# Altium project Temp.PrjPcb (part 1 of 2)
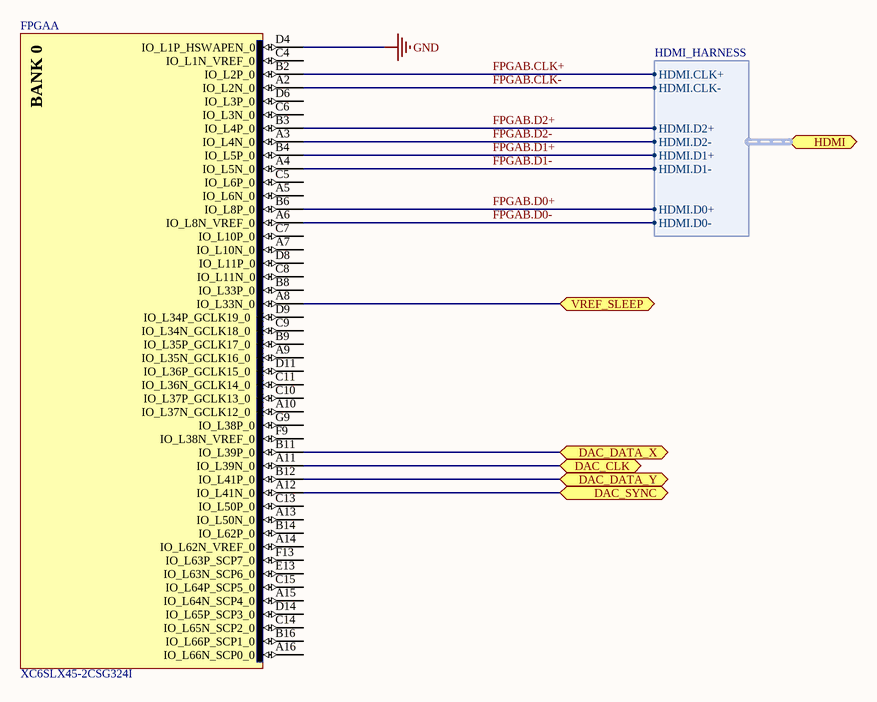
[diagram p0: FPGA Bank 0.SchDoc]
18 sheets, 125 parts. Net scope: flat (ports and power ports of the same name join across sheets).
Board files: PCB1.PcbDoc, VECTOR.PcbDoc, VECTOR_routed.PcbDoc
Sheets:
  Temp.SchDoc
  FPGA Bank 0.SchDoc
  FPGA Bank 1.SchDoc
  FPGA Bank 2.SchDoc
  Clocks.SchDoc
  EFM Power.SchDoc
  FPGA Config.SchDoc
  FPGA Bank 3.SchDoc
  FPGA_VCC.SchDoc
  FPGA Ground.SchDoc
  EFM.SchDoc
  DAC.SchDoc
  SRAM.SchDoc
  Power Supply.SchDoc
  Flash.SchDoc
  HDMI.SchDoc
  JoystickButtons.SchDoc
  Frame Buffer.SchDoc

## Sheet Temp.SchDoc
size A4

## Sheet FPGA Bank 0.SchDoc
size A4

### Parts
FPGA  XC6SLX45-2CSG324I  [CSG324]  (part A of 8)

### Ports
DAC_CLK, DAC_DATA_X, DAC_DATA_Y, DAC_SYNC, HDMI (harness HDMI_HARNESS), VREF_SLEEP

### Harnesses
HDMI_HARNESS: HDMI.D2+, HDMI.D2-, HDMI.D1+, HDMI.D1-, HDMI.D0+, HDMI.D0-, HDMI.CLK+, HDMI.CLK-

### Nets
GND: FPGA.D4(IO_L1P_HSWAPEN_0)
FPGAB.CLK+: FPGA.B2(IO_L2P_0) ; port HDMI.HDMI.CLK+
FPGAB.CLK-: FPGA.A2(IO_L2N_0) ; port HDMI.HDMI.CLK-
FPGAB.D0+: FPGA.B6(IO_L8P_0) ; port HDMI.HDMI.D0+
FPGAB.D0-: FPGA.A6(IO_L8N_VREF_0) ; port HDMI.HDMI.D0-
FPGAB.D1+: FPGA.B4(IO_L5P_0) ; port HDMI.HDMI.D1+
FPGAB.D1-: FPGA.A4(IO_L5N_0) ; port HDMI.HDMI.D1-
FPGAB.D2+: FPGA.B3(IO_L4P_0) ; port HDMI.HDMI.D2+
FPGAB.D2-: FPGA.A3(IO_L4N_0) ; port HDMI.HDMI.D2-
NetFPGA_A8: FPGA.A8(IO_L33N_0) ; port VREF_SLEEP
NetFPGA_A11: FPGA.A11(IO_L39N_0) ; port DAC_CLK
NetFPGA_A12: FPGA.A12(IO_L41N_0) ; port DAC_SYNC
NetFPGA_B11: FPGA.B11(IO_L39P_0) ; port DAC_DATA_X
NetFPGA_B12: FPGA.B12(IO_L41P_0) ; port DAC_DATA_Y

Not connected (* = marked no-connect by the designer): FPGA A5(IO_L6N_0) A7(IO_L10N_0) A9(IO_L35N_GCLK16_0) A10(IO_L37N_GCLK12_0) A13(IO_L50N_0) A14(IO_L62N_VREF_0) A15(IO_L64N_SCP4_0) A16(IO_L66N_SCP0_0) B8(IO_L33P_0) B9(IO_L35P_GCLK17_0) B14(IO_L62P_0) B16(IO_L66P_SCP1_0) C4(IO_L1N_VREF_0) C5(IO_L6P_0) C6(IO_L3N_0) C7(IO_L10P_0) C8(IO_L11N_0) C9(IO_L34N_GCLK18_0) C10(IO_L37P_GCLK13_0) C11(IO_L36N_GCLK14_0) C13(IO_L50P_0) C14(IO_L65N_SCP2_0) C15(IO_L64P_SCP5_0) D6(IO_L3P_0) D8(IO_L11P_0) D9(IO_L34P_GCLK19_0) D11(IO_L36P_GCLK15_0) D14(IO_L65P_SCP3_0) E13(IO_L63N_SCP6_0) F9(IO_L38N_VREF_0) F13(IO_L63P_SCP7_0) G9(IO_L38P_0)

### Notes on the sheet
- (in symbol XC6SLX45-2CSG324I, part A) BANK 0

### Library data of the parts
FPGA = XC6SLX45-2CSG324I: Spartan-6 LX 1.2V FPGA, 218 User I/Os, 324-Ball Chip-Scale BGA (0.8mm Pitch), Speed Grade 2, Industrial Grade, Pb-Free; Published: 17-Nov-2009; DatasheetVersion: ver1.6, Nov-2010; PackageVersion: ver1.1, Nov-2009; PackageReference: CSG324; Publisher: Altium Limited; PackageDescription: 324-Ball Chip-Scale BGA (CSG324) Package, 0.8 mm Pitch; Supplier 1: Digi-Key; Supplier Part Number 1: XC6SLX45-2CSG324I-ND; Code_JEDEC: MO-275-KKAC-1; ComponentLink1Description: Manufacturer Link; ComponentLink1URL: http://www.xilinx.com; ComponentLink2Description: Spartan-6 Datasheet; ComponentLink2URL: http://www.xilinx.com/support/documentation/data_sheets/ds160.pdf; ComponentLink3Description: Spartan-6 Documents; ComponentLink3URL: http://www.xilinx.com/support/documentation/spartan-6.htm; ComponentLink4Description: Xilinx.com Home; ComponentLink4URL: http://www.xilinx.com

## Sheet FPGA Bank 1.SchDoc
size A4
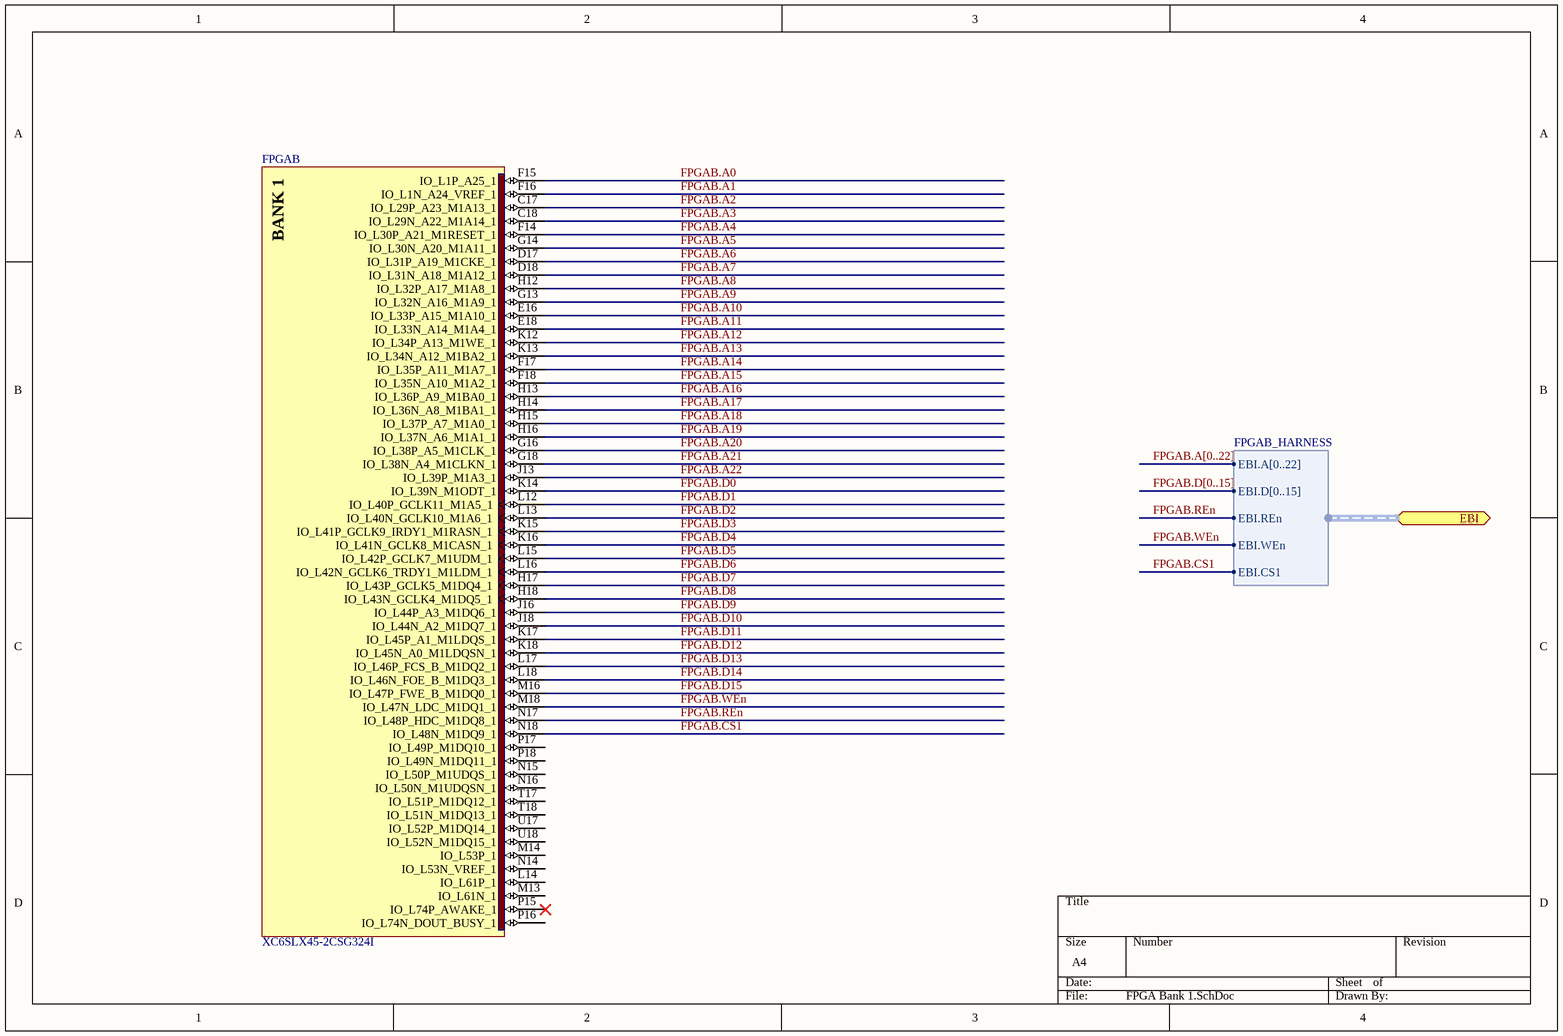
[diagram p1: FPGA Bank 1.SchDoc]

### Parts
FPGA  XC6SLX45-2CSG324I  [CSG324]  (part B of 8)

### Ports
EBI (harness FPGAB_HARNESS)

### Harnesses
FPGAB_HARNESS: EBI.A[0..22], EBI.D[0..15], EBI.REn, EBI.WEn, EBI.CS1

### Nets
FPGAB.A0: FPGA.F15(IO_L1P_A25_1)  [project net EBI.A0]
FPGAB.A1: FPGA.F16(IO_L1N_A24_VREF_1)  [project net EBI.A1]
FPGAB.A2: FPGA.C17(IO_L29P_A23_M1A13_1)  [project net EBI.A2]
FPGAB.A3: FPGA.C18(IO_L29N_A22_M1A14_1)  [project net EBI.A3]
FPGAB.A4: FPGA.F14(IO_L30P_A21_M1RESET_1)  [project net EBI.A4]
FPGAB.A5: FPGA.G14(IO_L30N_A20_M1A11_1)  [project net EBI.A5]
FPGAB.A6: FPGA.D17(IO_L31P_A19_M1CKE_1)  [project net EBI.A6]
FPGAB.A7: FPGA.D18(IO_L31N_A18_M1A12_1)  [project net EBI.A7]
FPGAB.A8: FPGA.H12(IO_L32P_A17_M1A8_1)  [project net EBI.A8]
FPGAB.A9: FPGA.G13(IO_L32N_A16_M1A9_1)  [project net EBI.A9]
FPGAB.A10: FPGA.E16(IO_L33P_A15_M1A10_1)  [project net EBI.A10]
FPGAB.A11: FPGA.E18(IO_L33N_A14_M1A4_1)  [project net EBI.A11]
FPGAB.A12: FPGA.K12(IO_L34P_A13_M1WE_1)  [project net EBI.A12]
FPGAB.A13: FPGA.K13(IO_L34N_A12_M1BA2_1)  [project net EBI.A13]
FPGAB.A14: FPGA.F17(IO_L35P_A11_M1A7_1)  [project net EBI.A14]
FPGAB.A15: FPGA.F18(IO_L35N_A10_M1A2_1)  [project net EBI.A15]
FPGAB.A16: FPGA.H13(IO_L36P_A9_M1BA0_1)  [project net EBI.A16]
FPGAB.A17: FPGA.H14(IO_L36N_A8_M1BA1_1)  [project net EBI.A17]
FPGAB.A18: FPGA.H15(IO_L37P_A7_M1A0_1)  [project net EBI.A18]
FPGAB.A19: FPGA.H16(IO_L37N_A6_M1A1_1)  [project net EBI.A19]
FPGAB.A20: FPGA.G16(IO_L38P_A5_M1CLK_1)  [project net EBI.A20]
FPGAB.A21: FPGA.G18(IO_L38N_A4_M1CLKN_1)  [project net EBI.A21]
FPGAB.A22: FPGA.J13(IO_L39P_M1A3_1)  [project net EBI.A22]
FPGAB.CS1: FPGA.N18(IO_L48N_M1DQ9_1) ; port EBI.EBI.CS1  [project net EBI.CS1]
FPGAB.D0: FPGA.K14(IO_L39N_M1ODT_1)  [project net EBI.D0]
FPGAB.D1: FPGA.L12(IO_L40P_GCLK11_M1A5_1)  [project net EBI.D1]
FPGAB.D2: FPGA.L13(IO_L40N_GCLK10_M1A6_1)  [project net EBI.D2]
FPGAB.D3: FPGA.K15(IO_L41P_GCLK9_IRDY1_M1RASN_1)  [project net EBI.D3]
FPGAB.D4: FPGA.K16(IO_L41N_GCLK8_M1CASN_1)  [project net EBI.D4]
FPGAB.D5: FPGA.L15(IO_L42P_GCLK7_M1UDM_1)  [project net EBI.D5]
FPGAB.D6: FPGA.L16(IO_L42N_GCLK6_TRDY1_M1LDM_1)  [project net EBI.D6]
FPGAB.D7: FPGA.H17(IO_L43P_GCLK5_M1DQ4_1)  [project net EBI.D7]
FPGAB.D8: FPGA.H18(IO_L43N_GCLK4_M1DQ5_1)  [project net EBI.D8]
FPGAB.D9: FPGA.J16(IO_L44P_A3_M1DQ6_1)  [project net EBI.D9]
FPGAB.D10: FPGA.J18(IO_L44N_A2_M1DQ7_1)  [project net EBI.D10]
FPGAB.D11: FPGA.K17(IO_L45P_A1_M1LDQS_1)  [project net EBI.D11]
FPGAB.D12: FPGA.K18(IO_L45N_A0_M1LDQSN_1)  [project net EBI.D12]
FPGAB.D13: FPGA.L17(IO_L46P_FCS_B_M1DQ2_1)  [project net EBI.D13]
FPGAB.D14: FPGA.L18(IO_L46N_FOE_B_M1DQ3_1)  [project net EBI.D14]
FPGAB.D15: FPGA.M16(IO_L47P_FWE_B_M1DQ0_1)  [project net EBI.D15]
FPGAB.REn: FPGA.N17(IO_L48P_HDC_M1DQ8_1) ; port EBI.EBI.REn  [project net EBI.REn]
FPGAB.WEn: FPGA.M18(IO_L47N_LDC_M1DQ1_1) ; port EBI.EBI.WEn  [project net EBI.WEn]

Not connected (* = marked no-connect by the designer): FPGA L14(IO_L61P_1) M13(IO_L61N_1) M14(IO_L53P_1) N14(IO_L53N_VREF_1) N15(IO_L50P_M1UDQS_1) N16(IO_L50N_M1UDQSN_1) P15(IO_L74P_AWAKE_1)* P16(IO_L74N_DOUT_BUSY_1) P17(IO_L49P_M1DQ10_1) P18(IO_L49N_M1DQ11_1) T17(IO_L51P_M1DQ12_1) T18(IO_L51N_M1DQ13_1) U17(IO_L52P_M1DQ14_1) U18(IO_L52N_M1DQ15_1)

### Buses and harness runs
bus FPGAB.A[0..22]
bus FPGAB.D[0..15]

### Notes on the sheet
- (in symbol XC6SLX45-2CSG324I, part B) BANK 1

### Library data of the parts
FPGA = XC6SLX45-2CSG324I: as FPGA on sheet FPGA Bank 0; Published: 17-Nov-2009; DatasheetVersion: ver1.6, Nov-2010; PackageVersion: ver1.1, Nov-2009; PackageReference: CSG324; Publisher: Altium Limited; PackageDescription: 324-Ball Chip-Scale BGA (CSG324) Package, 0.8 mm Pitch; Supplier 1: Digi-Key; Supplier Part Number 1: XC6SLX45-2CSG324I-ND; Code_JEDEC: MO-275-KKAC-1; ComponentLink1Description: Manufacturer Link; ComponentLink1URL: http://www.xilinx.com; ComponentLink2Description: Spartan-6 Datasheet; ComponentLink2URL: http://www.xilinx.com/support/documentation/data_sheets/ds160.pdf; ComponentLink3Description: Spartan-6 Documents; ComponentLink3URL: http://www.xilinx.com/support/documentation/spartan-6.htm; ComponentLink4Description: Xilinx.com Home; ComponentLink4URL: http://www.xilinx.com

## Sheet FPGA Bank 2.SchDoc
size A4
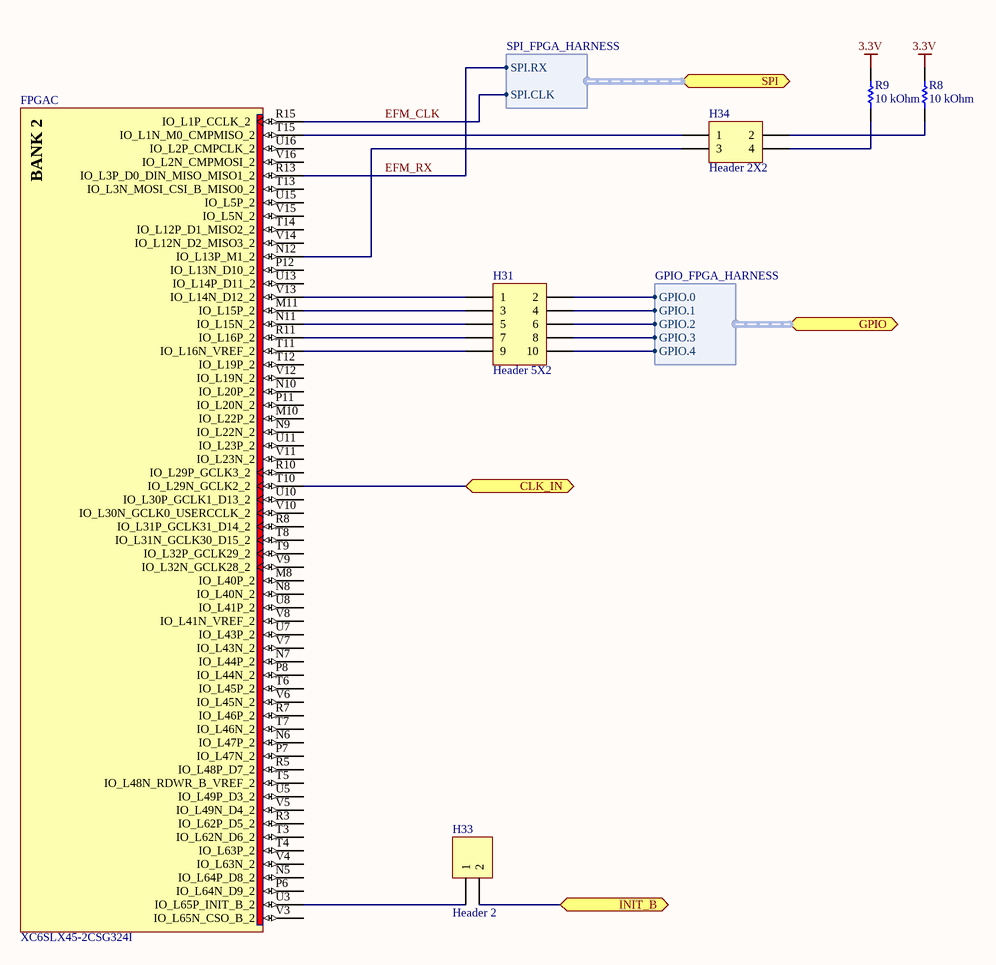
[diagram p2: FPGA Bank 2.SchDoc]

### Parts
FPGA  XC6SLX45-2CSG324I  [CSG324]  (part C of 8)
H31  Header 5X2  [HDR2X5]
H33  Header 2  [HDR1X2]
H34  Header 2X2  [HDR2X2]
R8  10 kOhm  [RESC0603(1608)_M]
R9  10 kOhm  [RESC0603(1608)_M]

### Ports
CLK_IN, GPIO (harness GPIO_FPGA_HARNESS), INIT_B, SPI (harness SPI_FPGA_HARNESS)

### Harnesses
GPIO_FPGA_HARNESS: GPIO.0, GPIO.1, GPIO.2, GPIO.3, GPIO.4
SPI_FPGA_HARNESS: SPI.RX, SPI.CLK

### Nets
3.3V: R8.2 R9.2
EFM_CLK: FPGA.R15(IO_L1P_CCLK_2) ; port SPI.SPI.CLK
EFM_RX: FPGA.R13(IO_L3P_D0_DIN_MISO_MISO1_2) ; port SPI.SPI.RX
GPIO.0: H31.2 ; port GPIO.GPIO.0
GPIO.1: H31.4 ; port GPIO.GPIO.1
GPIO.2: H31.6 ; port GPIO.GPIO.2
GPIO.3: H31.8 ; port GPIO.GPIO.3
GPIO.4: H31.10 ; port GPIO.GPIO.4
NetEFM32_H8: H33.2 ; port INIT_B
NetFPGA_M11: FPGA.M11(IO_L15P_2) H31.3
NetFPGA_N11: FPGA.N11(IO_L15N_2) H31.5
NetFPGA_N12: FPGA.N12(IO_L13P_M1_2) H34.3
NetFPGA_R11: FPGA.R11(IO_L16P_2) H31.7
NetFPGA_T10: FPGA.T10(IO_L29N_GCLK2_2) ; port CLK_IN
NetFPGA_T11: FPGA.T11(IO_L16N_VREF_2) H31.9
NetFPGA_T15: FPGA.T15(IO_L1N_M0_CMPMISO_2) H34.1
NetFPGA_U3: FPGA.U3(IO_L65P_INIT_B_2) H33.1
NetFPGA_V13: FPGA.V13(IO_L14N_D12_2) H31.1
NetH34_2: H34.2 R8.1
NetH34_4: H34.4 R9.1

Not connected (* = marked no-connect by the designer): FPGA M8(IO_L40P_2) M10(IO_L22P_2) N5(IO_L64P_D8_2) N6(IO_L47P_2) N7(IO_L44P_2) N8(IO_L40N_2) N9(IO_L22N_2) N10(IO_L20P_2) P6(IO_L64N_D9_2) P7(IO_L47N_2) P8(IO_L44N_2) P11(IO_L20N_2) P12(IO_L13N_D10_2) R3(IO_L62P_D5_2) R5(IO_L48P_D7_2) R7(IO_L46P_2) R8(IO_L31P_GCLK31_D14_2) R10(IO_L29P_GCLK3_2) T3(IO_L62N_D6_2) T4(IO_L63P_2) T5(IO_L48N_RDWR_B_VREF_2) T6(IO_L45P_2) T7(IO_L46N_2) T8(IO_L31N_GCLK30_D15_2) T9(IO_L32P_GCLK29_2) T12(IO_L19P_2) T13(IO_L3N_MOSI_CSI_B_MISO0_2) T14(IO_L12P_D1_MISO2_2) U5(IO_L49P_D3_2) U7(IO_L43P_2) U8(IO_L41P_2) U10(IO_L30P_GCLK1_D13_2) U11(IO_L23P_2) U13(IO_L14P_D11_2) U15(IO_L5P_2) U16(IO_L2P_CMPCLK_2) V3(IO_L65N_CSO_B_2) V4(IO_L63N_2) V5(IO_L49N_D4_2) V6(IO_L45N_2) V7(IO_L43N_2) V8(IO_L41N_VREF_2) V9(IO_L32N_GCLK28_2) V10(IO_L30N_GCLK0_USERCCLK_2) V11(IO_L23N_2) V12(IO_L19N_2) V14(IO_L12N_D2_MISO3_2) V15(IO_L5N_2) V16(IO_L2N_CMPMOSI_2)

### Notes on the sheet
- (in symbol XC6SLX45-2CSG324I, part C) BANK 2

### Library data of the parts
FPGA = XC6SLX45-2CSG324I: as FPGA on sheet FPGA Bank 0; Published: 17-Nov-2009; DatasheetVersion: ver1.6, Nov-2010; PackageVersion: ver1.1, Nov-2009; PackageReference: CSG324; Publisher: Altium Limited; PackageDescription: 324-Ball Chip-Scale BGA (CSG324) Package, 0.8 mm Pitch; Supplier 1: Digi-Key; Supplier Part Number 1: XC6SLX45-2CSG324I-ND; Code_JEDEC: MO-275-KKAC-1; ComponentLink1Description: Manufacturer Link; ComponentLink1URL: http://www.xilinx.com; ComponentLink2Description: Spartan-6 Datasheet; ComponentLink2URL: http://www.xilinx.com/support/documentation/data_sheets/ds160.pdf; ComponentLink3Description: Spartan-6 Documents; ComponentLink3URL: http://www.xilinx.com/support/documentation/spartan-6.htm; ComponentLink4Description: Xilinx.com Home; ComponentLink4URL: http://www.xilinx.com
H31 = Header 5X2: Header, 5-Pin, Dual row; LatestRevisionDate: 17-Jul-2002; LatestRevisionNote: Re-released for DXP Platform.; Publisher: Altium Limited
H33 = Header 2: Header, 2-Pin; LatestRevisionDate: 17-Jul-2002; LatestRevisionNote: Re-released for DXP Platform.; Publisher: Altium Limited
H34 = Header 2X2: Header, 2-Pin, Dual row; LatestRevisionDate: 17-Jul-2002; LatestRevisionNote: Re-released for DXP Platform.; Publisher: Altium Limited
R8 R9 = CMP-1012-00002-1: 1R 0.1W 5% 0603 (1608 Metric)  SMD; Case-Metric: 1608; Case-EIA: 0603; Power: 0.1 W; Technology: SMT; Value: 10 kOhm; Tolerance: 5 %

## Sheet Clocks.SchDoc
size A4
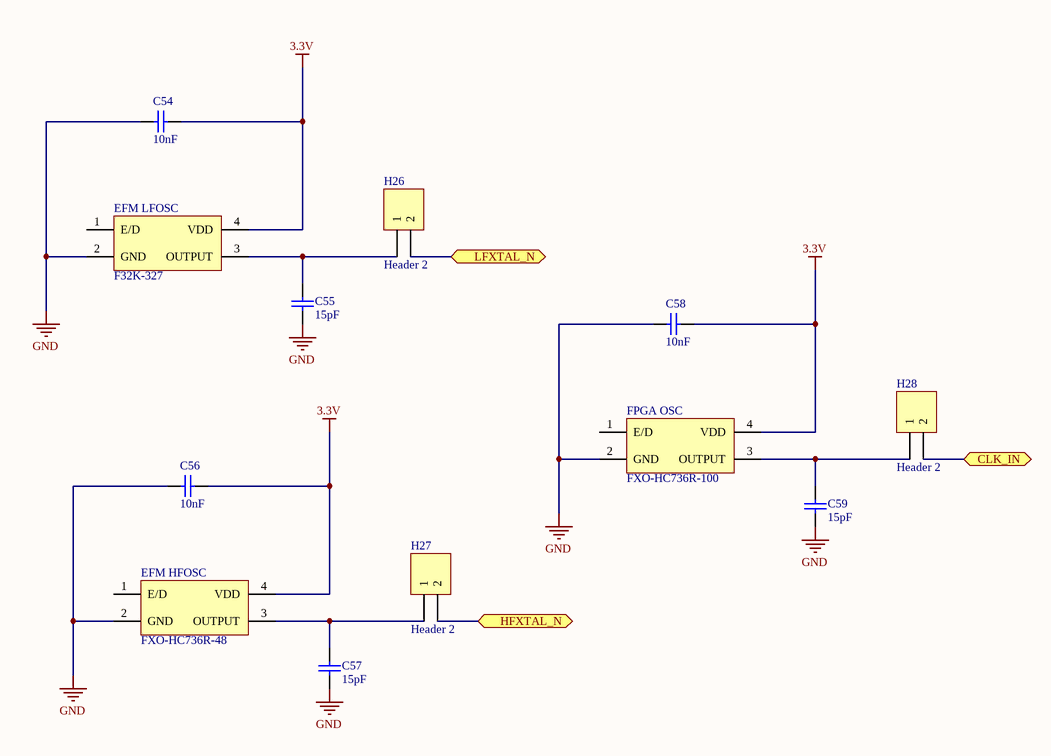
[diagram p3: Clocks.SchDoc]

### Parts
C54  10nF  [CAPC0603(1608)100_M]
C55  15pF  [CAPC0603(1608)100_M]
C56  10nF  [CAPC0603(1608)100_M]
C57  15pF  [CAPC0603(1608)100_M]
C58  10nF  [CAPC0603(1608)100_M]
C59  15pF  [CAPC0603(1608)100_M]
EFM_HFOSC  FXO-HC736R-48  [FPGA-OSC]
EFM_LFOSC  F32K-327  [LFOSC-32]
FPGA_OSC  FXO-HC736R-100  [FPGA-OSC]
H26  Header 2  [HDR1X2]
H27  Header 2  [HDR1X2]
H28  Header 2  [HDR1X2]

### Ports
CLK_IN, HFXTAL_N, LFXTAL_N

### Nets
3.3V: C54.2 C56.2 C58.2 EFM_HFOSC.4(VDD) EFM_LFOSC.4(VDD) FPGA_OSC.4(VDD)
GND: C54.1 C55.1 C56.1 C57.1 C58.1 C59.1 EFM_HFOSC.2(GND) EFM_LFOSC.2(GND) FPGA_OSC.2(GND)
NetC55_2: C55.2 EFM_LFOSC.3(OUTPUT) H26.1
NetC57_2: C57.2 EFM_HFOSC.3(OUTPUT) H27.1
NetC59_2: C59.2 FPGA_OSC.3(OUTPUT) H28.1
NetEFM32_L1: H26.2 ; port LFXTAL_N
NetEFM32_L9: H27.2 ; port HFXTAL_N
NetFPGA_T10: H28.2 ; port CLK_IN

Not connected (* = marked no-connect by the designer): EFM_HFOSC 1(E/D); EFM_LFOSC 1(E/D); FPGA_OSC 1(E/D)

### Library data of the parts
C54-C59 = CMP-1035-00001-1: CAP 0.5pF 10V Â±0.1pF 0603 (1608 Metric) Thickness 1mm SMD; Case-EIA: 0603; Case-Metric: 1608; Max Thickness: 1 mm; Tolerance: Â±0.1pF; Technology: SMT; Rated Voltage: 10 V
  C54 C56 C58: Value: 10nF
  C55 C57 C59: Value: 15pF
H26-H28 = Header 2: Header, 2-Pin; LatestRevisionDate: 17-Jul-2002; LatestRevisionNote: Re-released for DXP Platform.; Publisher: Altium Limited

## Sheet EFM Power.SchDoc
size A4
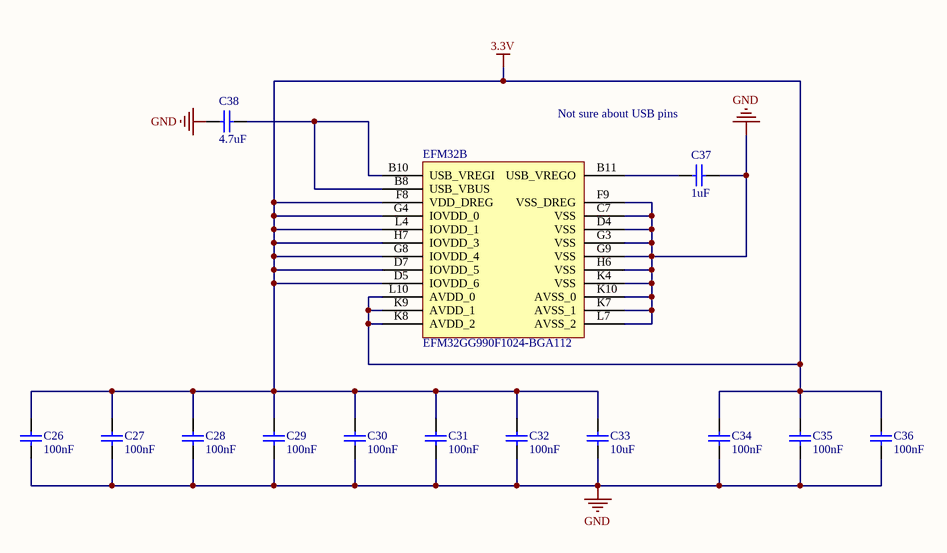
[diagram p4: EFM Power.SchDoc]

### Parts
C26  100nF  [CAPC0603(1608)100_M]
C27  100nF  [CAPC0603(1608)100_M]
C28  100nF  [CAPC0603(1608)100_M]
C29  100nF  [CAPC0603(1608)100_M]
C30  100nF  [CAPC0603(1608)100_M]
C31  100nF  [CAPC0603(1608)100_M]
C32  100nF  [CAPC0603(1608)100_M]
C33  10uF  [CAPC0603(1608)100_M]
C34  100nF  [CAPC0603(1608)100_M]
C35  100nF  [CAPC0603(1608)100_M]
C36  100nF  [CAPC0603(1608)100_M]
C37  1uF  [CAPC0603(1608)100_M]
C38  4.7uF  [CAPC0603(1608)100_M]
EFM32  EFM32GG990F1024-BGA112  [ENMR-BGA112]  (part B of 2)

### Nets
3.3V: C26.2 C27.2 C28.2 C29.2 C30.2 C31.2 C32.1 C33.1 C34.1 C35.1 C36.1 EFM32.D5(IOVDD_6) EFM32.D7(IOVDD_5) EFM32.F8(VDD_DREG) EFM32.G4(IOVDD_0) EFM32.G8(IOVDD_4) EFM32.H7(IOVDD_3) EFM32.K8(AVDD_2) EFM32.K9(AVDD_1) EFM32.L4(IOVDD_1) EFM32.L10(AVDD_0)
GND: C26.1 C27.1 C28.1 C29.1 C30.1 C31.1 C32.2 C33.2 C34.2 C35.2 C36.2 C37.2 C38.1 EFM32.C7(VSS) EFM32.D4(VSS) EFM32.F9(VSS_DREG) EFM32.G3(VSS) EFM32.G9(VSS) EFM32.H6(VSS) EFM32.K4(VSS) EFM32.K7(AVSS_1) EFM32.K10(AVSS_0) EFM32.L7(AVSS_2)
NetC37_1: C37.1 EFM32.B11(USB_VREGO)
NetC38_2: C38.2 EFM32.B8(USB_VBUS) EFM32.B10(USB_VREGI)

### Notes on the sheet
- Not sure about USB pins

### Library data of the parts
C26-C38 = CMP-1035-00001-1: as C54 on sheet Clocks; Max Thickness: 1 mm; Tolerance: Â±0.1pF; Technology: SMT; Rated Voltage: 10 V
  C26-C32 C34-C36: Value: 100nF
  C33: Value: 10uF
  C37: Value: 1uF
  C38: Value: 4.7uF
EFM32 = EFM32GG990F1024-BGA112: EFM32 Giant Gecko, M3 ARM Cortex CPU, 1024 KB Flash, 128 KB RAM, 1.85 - 3.8 V Supply, 48 MHz Max Speed, -40 to 85 degC, 112-Pin BGA, RoHS Compliant; Flash (KB): 1024; GPIO: 87; LCD: 8x34; LESENSE: Y; Max Speed (MHz): 48; OPAMPS: 3; RAM (KB): 128; DatasheetVersion: Rev 1.00; PackageVersion: Rev. 97SPP01315A_X03_06Jun11; PackageReference: BGA112; PackageDescription: 112-Pin Ball Grid Array, Body 10 x 10 mm, Pitch 0.8 mm; Supplier 1: Digi-Key; Supplier Part Number 1: 914-1051-2-ND; Supplier 2: Digi-Key; Supplier Part Number 2: 914-1051-1-ND; Supplier 3: Digi-Key; Supplier Part Number 3: 914-1051-6-ND; Supplier 4: Mouser; Supplier Part Number 4: 904-EFM32GG990F1024; ARM Cortex CPU: M3; Subcategory: EFM32 Giant Gecko; Supply Voltage (V): 1.85 - 3.8; USB: Y; Mounting Technology: Surface Mount; Generic Part Number: EFM32GG990; PartNumber: EFM32GG990F1024-BGA112; ComponentLink1Description: Manufacturer URL; ComponentLink1URL: http://www.energymicro.com/; ComponentLink2Description: Datasheet; ComponentLink2URL: http://cdn.energymicro.com/dl/devices/pdf/d0046_efm32gg990_datasheet.pdf; ComponentLink3Description: Package Specification; ComponentLink3URL: http://cdn.energymicro.com/dl/devices/pdf/d0007_efm32g290_datasheet.pdf

## Sheet FPGA Config.SchDoc
size A4
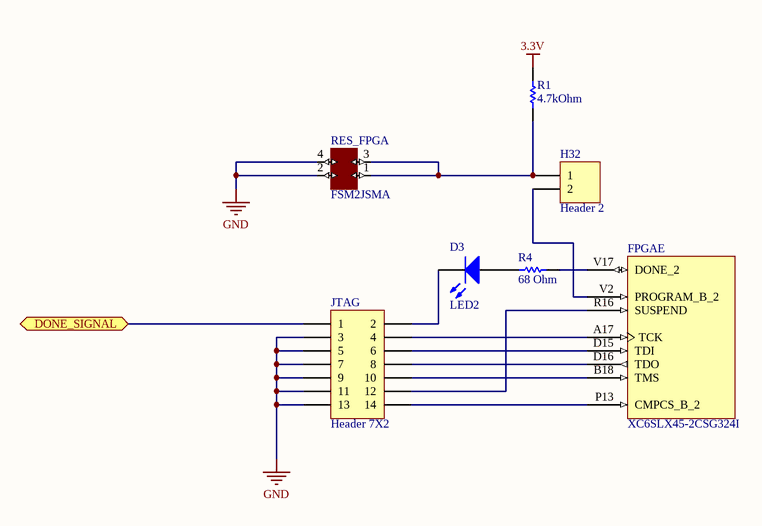
[diagram p5: FPGA Config.SchDoc]

### Parts
D3  LED2  [3.2X1.6X1.1]
FPGA  XC6SLX45-2CSG324I  [CSG324]  (part E of 8)
H32  Header 2  [HDR1X2]
JTAG  Header 7X2  [HDR2X7]
R1  4.7kOhm  [RESC0603(1608)_M]
R4  68 Ohm  [RESC0603(1608)_M]
RES_FPGA  FSM2JSMA  [Button]

### Ports
DONE_SIGNAL

### Nets
3.3V: R1.2
GND: JTAG.3 JTAG.5 JTAG.7 JTAG.9 JTAG.11 JTAG.13 RES_FPGA.2 RES_FPGA.4
NetD3_1: D3.1(A) R4.1
NetD3_2: D3.2(K) JTAG.2
NetEFM32_C10: JTAG.1 ; port DONE_SIGNAL
NetFPGA_A17: FPGA.A17(TCK) JTAG.4
NetFPGA_B18: FPGA.B18(TMS) JTAG.10
NetFPGA_D15: FPGA.D15(TDI) JTAG.6
NetFPGA_D16: FPGA.D16(TDO) JTAG.8
NetFPGA_P13: FPGA.P13(CMPCS_B_2) JTAG.14
NetFPGA_R16: FPGA.R16(SUSPEND) JTAG.12
NetFPGA_V2: FPGA.V2(PROGRAM_B_2) H32.2
NetFPGA_V17: FPGA.V17(DONE_2) R4.2
NetH32_1: H32.1 R1.1 RES_FPGA.1 RES_FPGA.3

### Library data of the parts
D3 = LED2: Typical RED, GREEN, YELLOW, AMBER GaAs LED; Published: 8-Jun-2000; LatestRevisionDate: 17-Jul-2002; LatestRevisionNote: Re-released for DXP Platform.; PackageVersion: Feb-2002; PackageReference: 3.2X1.6X1.1; Publisher: Altium Limited; PackageDescription: SM LED; 2 Flat Leads
FPGA = XC6SLX45-2CSG324I: as FPGA on sheet FPGA Bank 0; Published: 17-Nov-2009; DatasheetVersion: ver1.6, Nov-2010; PackageVersion: ver1.1, Nov-2009; PackageReference: CSG324; Publisher: Altium Limited; PackageDescription: 324-Ball Chip-Scale BGA (CSG324) Package, 0.8 mm Pitch; Supplier 1: Digi-Key; Supplier Part Number 1: XC6SLX45-2CSG324I-ND; Code_JEDEC: MO-275-KKAC-1; ComponentLink1Description: Manufacturer Link; ComponentLink1URL: http://www.xilinx.com; ComponentLink2Description: Spartan-6 Datasheet; ComponentLink2URL: http://www.xilinx.com/support/documentation/data_sheets/ds160.pdf; ComponentLink3Description: Spartan-6 Documents; ComponentLink3URL: http://www.xilinx.com/support/documentation/spartan-6.htm; ComponentLink4Description: Xilinx.com Home; ComponentLink4URL: http://www.xilinx.com
H32 = Header 2: Header, 2-Pin; LatestRevisionDate: 17-Jul-2002; LatestRevisionNote: Re-released for DXP Platform.; Publisher: Altium Limited
JTAG = Header 7X2: Header, 7-Pin, Dual row; LatestRevisionDate: 17-Jul-2002; LatestRevisionNote: Re-released for DXP Platform.; Publisher: Altium Limited
R1 R4 = CMP-1012-00002-1: as R8 on sheet FPGA Bank 2; Power: 0.1 W; Technology: SMT; Tolerance: 5 %
  R1: Value: 4.7kOhm
  R4: Value: 68 Ohm
RES_FPGA = switch-button

## Sheet FPGA Bank 3.SchDoc
size A4
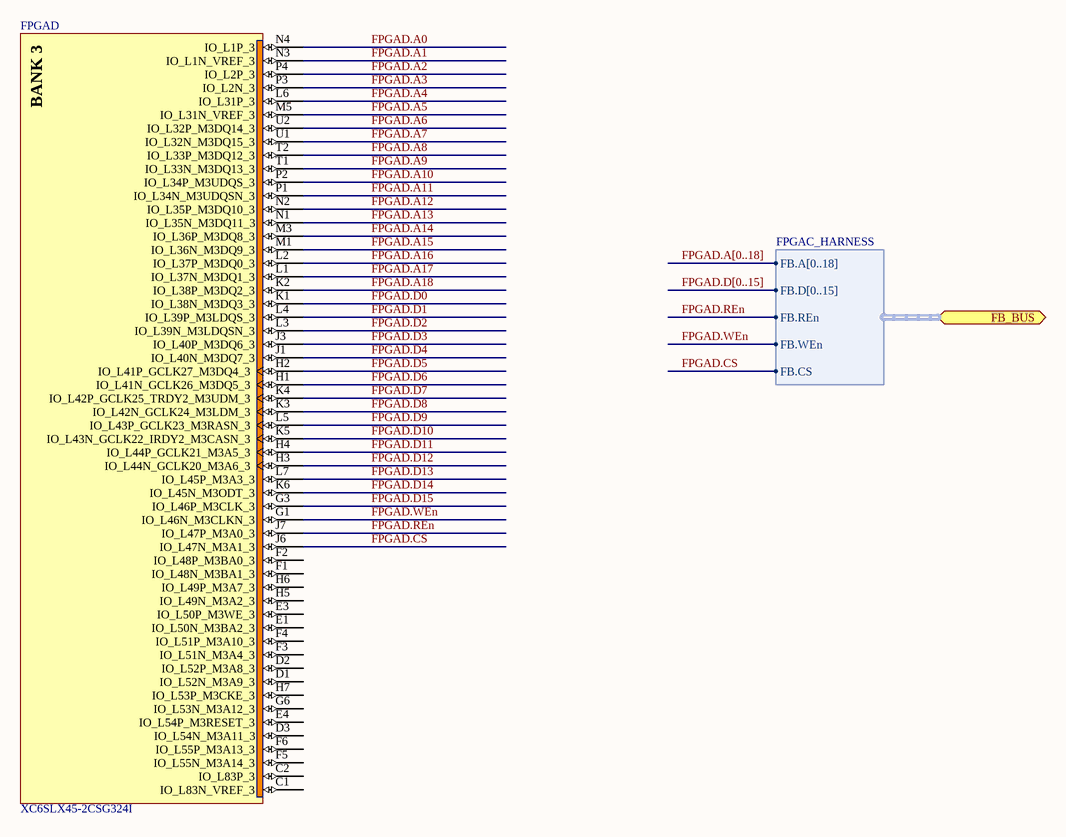
[diagram p6: FPGA Bank 3.SchDoc]

### Parts
FPGA  XC6SLX45-2CSG324I  [CSG324]  (part D of 8)

### Ports
FB_BUS (harness FPGAC_HARNESS)

### Harnesses
FPGAC_HARNESS: FB.A[0..18], FB.D[0..15], FB.REn, FB.WEn, FB.CS

### Nets
FPGAD.A0: FPGA.N4(IO_L1P_3)  [project net FB.A0]
FPGAD.A1: FPGA.N3(IO_L1N_VREF_3)  [project net FB.A1]
FPGAD.A2: FPGA.P4(IO_L2P_3)  [project net FB.A2]
FPGAD.A3: FPGA.P3(IO_L2N_3)  [project net FB.A3]
FPGAD.A4: FPGA.L6(IO_L31P_3)  [project net FB.A4]
FPGAD.A5: FPGA.M5(IO_L31N_VREF_3)  [project net FB.A5]
FPGAD.A6: FPGA.U2(IO_L32P_M3DQ14_3)  [project net FB.A6]
FPGAD.A7: FPGA.U1(IO_L32N_M3DQ15_3)  [project net FB.A7]
FPGAD.A8: FPGA.T2(IO_L33P_M3DQ12_3)  [project net FB.A8]
FPGAD.A9: FPGA.T1(IO_L33N_M3DQ13_3)  [project net FB.A9]
FPGAD.A10: FPGA.P2(IO_L34P_M3UDQS_3)  [project net FB.A10]
FPGAD.A11: FPGA.P1(IO_L34N_M3UDQSN_3)  [project net FB.A11]
FPGAD.A12: FPGA.N2(IO_L35P_M3DQ10_3)  [project net FB.A12]
FPGAD.A13: FPGA.N1(IO_L35N_M3DQ11_3)  [project net FB.A13]
FPGAD.A14: FPGA.M3(IO_L36P_M3DQ8_3)  [project net FB.A14]
FPGAD.A15: FPGA.M1(IO_L36N_M3DQ9_3)  [project net FB.A15]
FPGAD.A16: FPGA.L2(IO_L37P_M3DQ0_3)  [project net FB.A16]
FPGAD.A17: FPGA.L1(IO_L37N_M3DQ1_3)  [project net FB.A17]
FPGAD.A18: FPGA.K2(IO_L38P_M3DQ2_3)  [project net FB.A18]
FPGAD.CS: FPGA.J6(IO_L47N_M3A1_3) ; port FB_BUS.FB.CS  [project net FB.CS]
FPGAD.D0: FPGA.K1(IO_L38N_M3DQ3_3)  [project net FB.D0]
FPGAD.D1: FPGA.L4(IO_L39P_M3LDQS_3)  [project net FB.D1]
FPGAD.D2: FPGA.L3(IO_L39N_M3LDQSN_3)  [project net FB.D2]
FPGAD.D3: FPGA.J3(IO_L40P_M3DQ6_3)  [project net FB.D3]
FPGAD.D4: FPGA.J1(IO_L40N_M3DQ7_3)  [project net FB.D4]
FPGAD.D5: FPGA.H2(IO_L41P_GCLK27_M3DQ4_3)  [project net FB.D5]
FPGAD.D6: FPGA.H1(IO_L41N_GCLK26_M3DQ5_3)  [project net FB.D6]
FPGAD.D7: FPGA.K4(IO_L42P_GCLK25_TRDY2_M3UDM_3)  [project net FB.D7]
FPGAD.D8: FPGA.K3(IO_L42N_GCLK24_M3LDM_3)  [project net FB.D8]
FPGAD.D9: FPGA.L5(IO_L43P_GCLK23_M3RASN_3)  [project net FB.D9]
FPGAD.D10: FPGA.K5(IO_L43N_GCLK22_IRDY2_M3CASN_3)  [project net FB.D10]
FPGAD.D11: FPGA.H4(IO_L44P_GCLK21_M3A5_3)  [project net FB.D11]
FPGAD.D12: FPGA.H3(IO_L44N_GCLK20_M3A6_3)  [project net FB.D12]
FPGAD.D13: FPGA.L7(IO_L45P_M3A3_3)  [project net FB.D13]
FPGAD.D14: FPGA.K6(IO_L45N_M3ODT_3)  [project net FB.D14]
FPGAD.D15: FPGA.G3(IO_L46P_M3CLK_3)  [project net FB.D15]
FPGAD.REn: FPGA.J7(IO_L47P_M3A0_3) ; port FB_BUS.FB.REn  [project net FB.REn]
FPGAD.WEn: FPGA.G1(IO_L46N_M3CLKN_3) ; port FB_BUS.FB.WEn  [project net FB.WEn]

Not connected (* = marked no-connect by the designer): FPGA C1(IO_L83N_VREF_3) C2(IO_L83P_3) D1(IO_L52N_M3A9_3) D2(IO_L52P_M3A8_3) D3(IO_L54N_M3A11_3) E1(IO_L50N_M3BA2_3) E3(IO_L50P_M3WE_3) E4(IO_L54P_M3RESET_3) F1(IO_L48N_M3BA1_3) F2(IO_L48P_M3BA0_3) F3(IO_L51N_M3A4_3) F4(IO_L51P_M3A10_3) F5(IO_L55N_M3A14_3) F6(IO_L55P_M3A13_3) G6(IO_L53N_M3A12_3) H5(IO_L49N_M3A2_3) H6(IO_L49P_M3A7_3) H7(IO_L53P_M3CKE_3)

### Buses and harness runs
bus FPGAD.A[0..18]
bus FPGAD.D[0..15]

### Notes on the sheet
- (in symbol XC6SLX45-2CSG324I, part D) BANK 3

### Library data of the parts
FPGA = XC6SLX45-2CSG324I: as FPGA on sheet FPGA Bank 0; Published: 17-Nov-2009; DatasheetVersion: ver1.6, Nov-2010; PackageVersion: ver1.1, Nov-2009; PackageReference: CSG324; Publisher: Altium Limited; PackageDescription: 324-Ball Chip-Scale BGA (CSG324) Package, 0.8 mm Pitch; Supplier 1: Digi-Key; Supplier Part Number 1: XC6SLX45-2CSG324I-ND; Code_JEDEC: MO-275-KKAC-1; ComponentLink1Description: Manufacturer Link; ComponentLink1URL: http://www.xilinx.com; ComponentLink2Description: Spartan-6 Datasheet; ComponentLink2URL: http://www.xilinx.com/support/documentation/data_sheets/ds160.pdf; ComponentLink3Description: Spartan-6 Documents; ComponentLink3URL: http://www.xilinx.com/support/documentation/spartan-6.htm; ComponentLink4Description: Xilinx.com Home; ComponentLink4URL: http://www.xilinx.com

## Sheet FPGA_VCC.SchDoc: DmPro15 Vector FPGA VCC
size A4
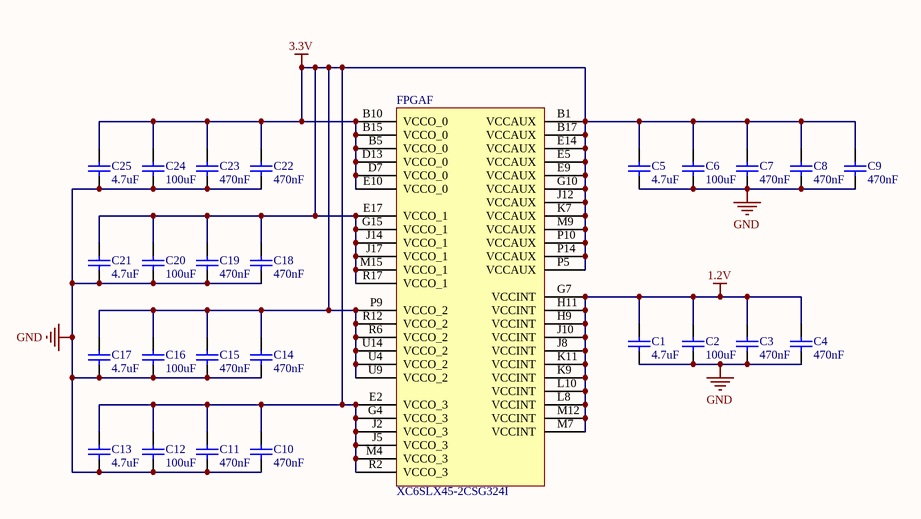
[diagram p7: FPGA_VCC.SchDoc]

### Parts
C1  4.7uF  [CAPC0603(1608)100_M]
C2  100uF  [CAPC0805(2012)75_L]
C3  470nF  [CAPC0603(1608)100_M]
C4  470nF  [CAPC0603(1608)100_M]
C5  4.7uF  [CAPC0603(1608)100_M]
C6  100uF  [CAPC0805(2012)75_L]
C7  470nF  [CAPC0603(1608)100_M]
C8  470nF  [CAPC0603(1608)100_M]
C9  470nF  [CAPC0603(1608)100_M]
C10  470nF  [CAPC0603(1608)100_M]
C11  470nF  [CAPC0603(1608)100_M]
C12  100uF  [CAPC0805(2012)75_L]
C13  4.7uF  [CAPC0603(1608)100_M]
C14  470nF  [CAPC0603(1608)100_M]
C15  470nF  [CAPC0603(1608)100_M]
C16  100uF  [CAPC0805(2012)75_L]
C17  4.7uF  [CAPC0603(1608)100_M]
C18  470nF  [CAPC0603(1608)100_M]
C19  470nF  [CAPC0603(1608)100_M]
C20  100uF  [CAPC0805(2012)75_L]
C21  4.7uF  [CAPC0603(1608)100_M]
C22  470nF  [CAPC0603(1608)100_M]
C23  470nF  [CAPC0603(1608)100_M]
C24  100uF  [CAPC0805(2012)75_L]
C25  4.7uF  [CAPC0603(1608)100_M]
FPGA  XC6SLX45-2CSG324I  [CSG324]  (part F of 8)

### Nets
1.2V: C1.2 C2.2 C3.2 C4.2 FPGA.G7(VCCINT) FPGA.H9(VCCINT) FPGA.H11(VCCINT) FPGA.J8(VCCINT) FPGA.J10(VCCINT) FPGA.K9(VCCINT) FPGA.K11(VCCINT) FPGA.L8(VCCINT) FPGA.L10(VCCINT) FPGA.M7(VCCINT) FPGA.M12(VCCINT)
3.3V: C5.2 C6.2 C7.2 C8.2 C9.2 C10.2 C11.2 C12.2 C13.2 C14.2 C15.2 C16.2 C17.2 C18.2 C19.2 C20.2 C21.2 C22.2 C23.2 C24.2 C25.2 FPGA.B1(VCCAUX) FPGA.B5(VCCO_0) FPGA.B10(VCCO_0) FPGA.B15(VCCO_0) FPGA.B17(VCCAUX) FPGA.D7(VCCO_0) FPGA.D13(VCCO_0) FPGA.E2(VCCO_3) FPGA.E5(VCCAUX) FPGA.E9(VCCAUX) FPGA.E10(VCCO_0) FPGA.E14(VCCAUX) FPGA.E17(VCCO_1) FPGA.G4(VCCO_3) FPGA.G10(VCCAUX) FPGA.G15(VCCO_1) FPGA.J2(VCCO_3) FPGA.J5(VCCO_3) FPGA.J12(VCCAUX) FPGA.J14(VCCO_1) FPGA.J17(VCCO_1) FPGA.K7(VCCAUX) FPGA.M4(VCCO_3) FPGA.M9(VCCAUX) FPGA.M15(VCCO_1) FPGA.P5(VCCAUX) FPGA.P9(VCCO_2) FPGA.P10(VCCAUX) FPGA.P14(VCCAUX) FPGA.R2(VCCO_3) FPGA.R6(VCCO_2) FPGA.R12(VCCO_2) FPGA.R17(VCCO_1) FPGA.U4(VCCO_2) FPGA.U9(VCCO_2) FPGA.U14(VCCO_2)
GND: C1.1 C2.1 C3.1 C4.1 C5.1 C6.1 C7.1 C8.1 C9.1 C10.1 C11.1 C12.1 C13.1 C14.1 C15.1 C16.1 C17.1 C18.1 C19.1 C20.1 C21.1 C22.1 C23.1 C24.1 C25.1

### Notes on the sheet
- Title
- Size:
- Date:
- A4
- Number:
- Time:
- Revision:
- Sheet
- of
- File:

### Library data of the parts
C1 C3-C5 C7-C11 C13-C15 C17-C19 C21-C23 C25 = CMP-1035-00001-1: as C54 on sheet Clocks; Max Thickness: 1 mm; Tolerance: Â±0.1pF; Technology: SMT; Rated Voltage: 10 V
  C1 C5 C13 C17 C21 C25: Value: 4.7uF
  C3 C4 C7-C11 C14 C15 C18 C19 C22 C23: Value: 470nF
C2 C6 C12 C16 C20 C24 = CMP-1036-00001-1: CAP 0.5pF 10V Â±0.1pF 0805 (2012 Metric) Thickness 0.75mm SMD; Case-Metric: 2012; Case-EIA: 0805; Tolerance: Â±0.1pF; Max Thickness: 0.75 mm; Technology: SMT; Rated Voltage: 10 V; Value: 100uF
FPGA = XC6SLX45-2CSG324I: as FPGA on sheet FPGA Bank 0; DatasheetVersion: ver1.6, Nov-2010; PackageVersion: ver1.1, Nov-2009; PackageReference: CSG324; PackageDescription: 324-Ball Chip-Scale BGA (CSG324) Package, 0.8 mm Pitch; Code_JEDEC: MO-275-KKAC-1; ComponentLink1Description: Manufacturer URL; ComponentLink1URL: http://www.xilinx.com/; ComponentLink2Description: Spartan-6 Datasheet; ComponentLink2URL: http://www.xilinx.com/support/documentation/data_sheets/ds160.pdf; ComponentLink3Description: Spartan-6 Documents; ComponentLink3URL: http://www.xilinx.com/support/documentation/spartan-6.htm

## Sheet FPGA Ground.SchDoc
size A4
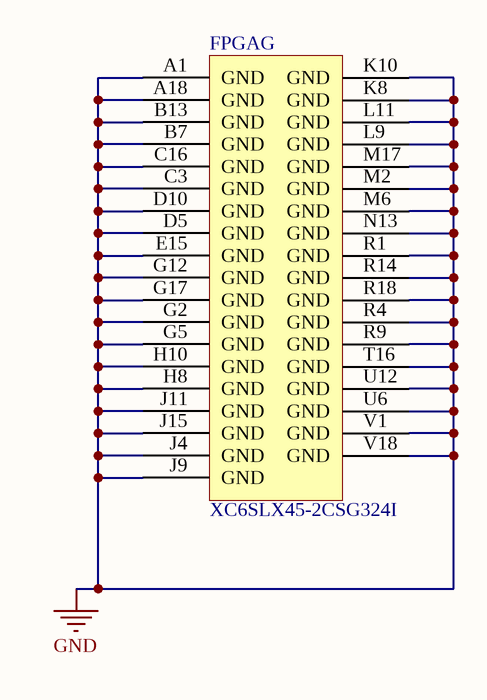
[diagram p8: FPGA Ground.SchDoc]

### Parts
FPGA  XC6SLX45-2CSG324I  [CSG324]  (part G of 8)

### Nets
GND: FPGA.A1(GND) FPGA.A18(GND) FPGA.B7(GND) FPGA.B13(GND) FPGA.C3(GND) FPGA.C16(GND) FPGA.D5(GND) FPGA.D10(GND) FPGA.E15(GND) FPGA.G2(GND) FPGA.G5(GND) FPGA.G12(GND) FPGA.G17(GND) FPGA.H8(GND) FPGA.H10(GND) FPGA.J4(GND) FPGA.J9(GND) FPGA.J11(GND) FPGA.J15(GND) FPGA.K8(GND) FPGA.K10(GND) FPGA.L9(GND) FPGA.L11(GND) FPGA.M2(GND) FPGA.M6(GND) FPGA.M17(GND) FPGA.N13(GND) FPGA.R1(GND) FPGA.R4(GND) FPGA.R9(GND) FPGA.R14(GND) FPGA.R18(GND) FPGA.T16(GND) FPGA.U6(GND) FPGA.U12(GND) FPGA.V1(GND) FPGA.V18(GND)

### Library data of the parts
FPGA = XC6SLX45-2CSG324I: as FPGA on sheet FPGA Bank 0; Published: 17-Nov-2009; DatasheetVersion: ver1.6, Nov-2010; PackageVersion: ver1.1, Nov-2009; PackageReference: CSG324; Publisher: Altium Limited; PackageDescription: 324-Ball Chip-Scale BGA (CSG324) Package, 0.8 mm Pitch; Supplier 1: Digi-Key; Supplier Part Number 1: XC6SLX45-2CSG324I-ND; Code_JEDEC: MO-275-KKAC-1; ComponentLink1Description: Manufacturer Link; ComponentLink1URL: http://www.xilinx.com; ComponentLink2Description: Spartan-6 Datasheet; ComponentLink2URL: http://www.xilinx.com/support/documentation/data_sheets/ds160.pdf; ComponentLink3Description: Spartan-6 Documents; ComponentLink3URL: http://www.xilinx.com/support/documentation/spartan-6.htm; ComponentLink4Description: Xilinx.com Home; ComponentLink4URL: http://www.xilinx.com

## Sheet EFM.SchDoc
size A4
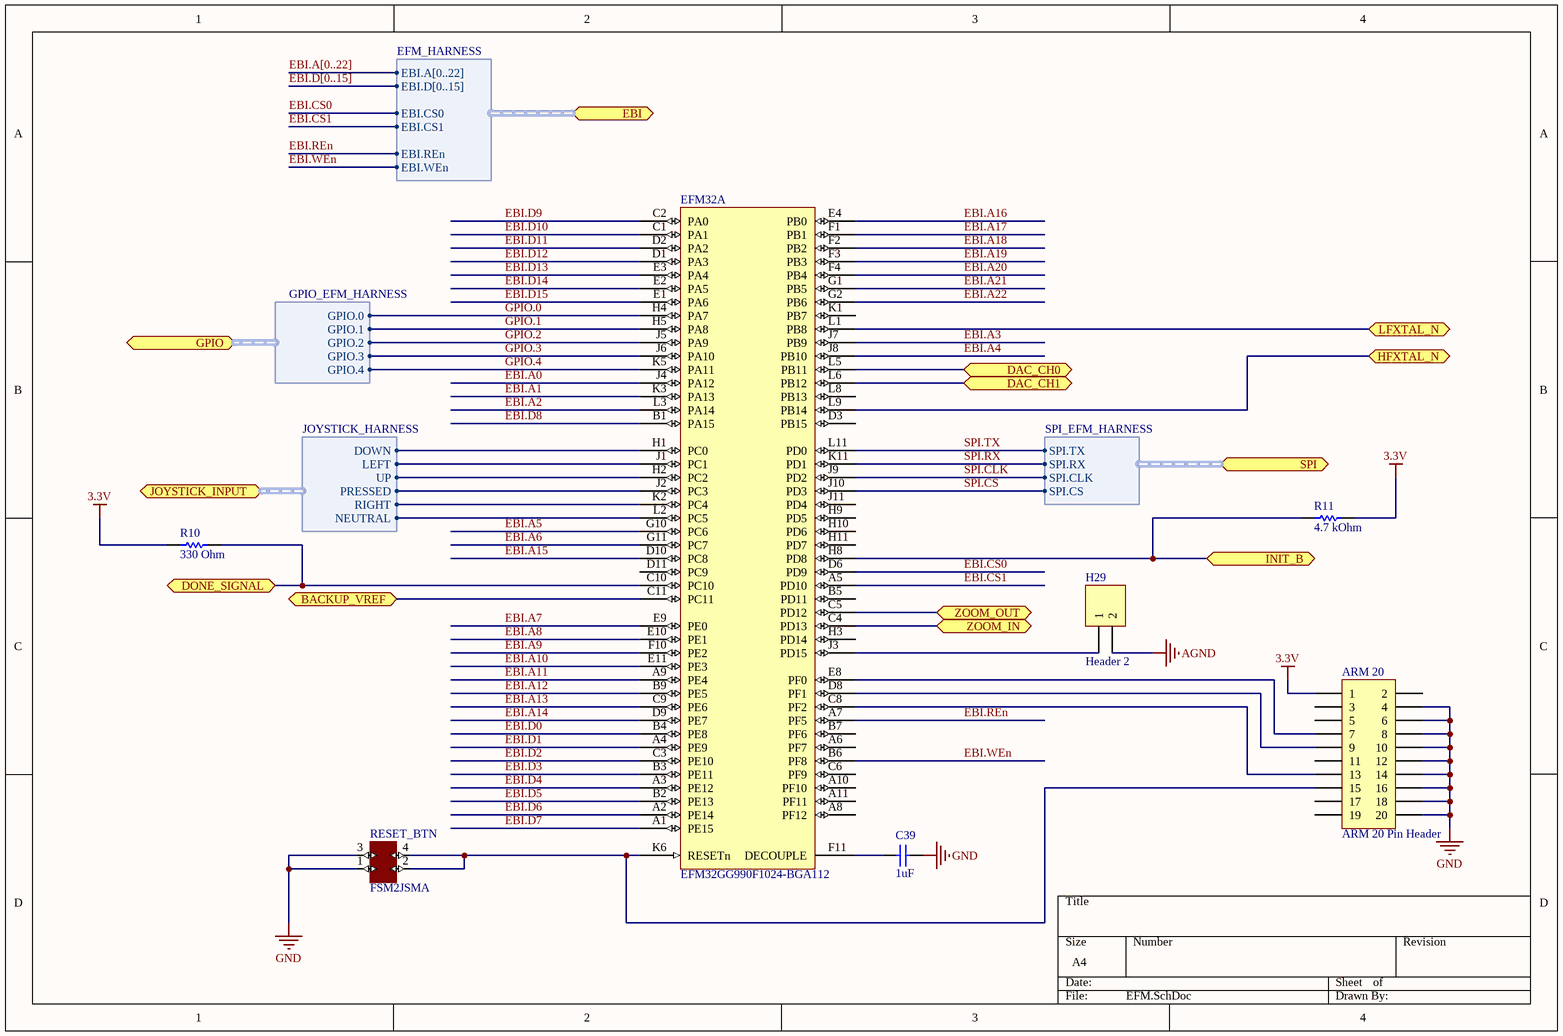
[diagram p9: EFM.SchDoc]

### Parts
ARM_20  ARM 20 Pin Header  [HDR2X10]
C39  1uF  [CAPC0603(1608)100_M]
EFM32  EFM32GG990F1024-BGA112  [ENMR-BGA112]  (part A of 2)
H29  Header 2  [HDR1X2]
R10  330 Ohm  [RESC0603(1608)_M]
R11  4.7 kOhm  [RESC0603(1608)_M]
RESET_BTN  FSM2JSMA  [Button]

### Ports
BACKUP_VREF, DAC_CH0, DAC_CH1, DONE_SIGNAL, EBI (harness EFM_HARNESS), GPIO (harness GPIO_EFM_HARNESS), HFXTAL_N, INIT_B, JOYSTICK_INPUT (harness JOYSTICK_HARNESS), LFXTAL_N, SPI (harness SPI_EFM_HARNESS), ZOOM_IN, ZOOM_OUT

### Harnesses
JOYSTICK_HARNESS: DOWN, LEFT, UP, PRESSED, RIGHT, NEUTRAL
EFM_HARNESS: EBI.A[0..22], EBI.D[0..15], EBI.CS0, EBI.CS1, EBI.REn, EBI.WEn
GPIO_EFM_HARNESS: GPIO.0, GPIO.1, GPIO.2, GPIO.3, GPIO.4
SPI_EFM_HARNESS: SPI.TX, SPI.RX, SPI.CLK, SPI.CS

### Nets
3.3V: ARM_20.1 R10.1 R11.2
AGND: H29.2
GND: ARM_20.4 ARM_20.6 ARM_20.8 ARM_20.10 ARM_20.12 ARM_20.14 ARM_20.16 ARM_20.18 ARM_20.20 C39.2 RESET_BTN.1 RESET_BTN.3
EBI.A0: EFM32.J4(PA12)
EBI.A1: EFM32.K3(PA13)
EBI.A2: EFM32.L3(PA14)
EBI.A3: EFM32.J7(PB9)
EBI.A4: EFM32.J8(PB10)
EBI.A5: EFM32.G10(PC6)
EBI.A6: EFM32.G11(PC7)
EBI.A7: EFM32.E9(PE0)
EBI.A8: EFM32.E10(PE1)
EBI.A9: EFM32.F10(PE2)
EBI.A10: EFM32.E11(PE3)
EBI.A11: EFM32.A9(PE4)
EBI.A12: EFM32.B9(PE5)
EBI.A13: EFM32.C9(PE6)
EBI.A14: EFM32.D9(PE7)
EBI.A15: EFM32.D10(PC8)
EBI.A16: EFM32.E4(PB0)
EBI.A17: EFM32.F1(PB1)
EBI.A18: EFM32.F2(PB2)
EBI.A19: EFM32.F3(PB3)
EBI.A20: EFM32.F4(PB4)
EBI.A21: EFM32.G1(PB5)
EBI.A22: EFM32.G2(PB6)
EBI.CS0: EFM32.D6(PD9) ; port EBI.EBI.CS0
EBI.CS1: EFM32.A5(PD10) ; port EBI.EBI.CS1
EBI.D0: EFM32.B4(PE8)
EBI.D1: EFM32.A4(PE9)
EBI.D2: EFM32.C3(PE10)
EBI.D3: EFM32.B3(PE11)
EBI.D4: EFM32.A3(PE12)
EBI.D5: EFM32.B2(PE13)
EBI.D6: EFM32.A2(PE14)
EBI.D7: EFM32.A1(PE15)
EBI.D8: EFM32.B1(PA15)
EBI.D9: EFM32.C2(PA0)
EBI.D10: EFM32.C1(PA1)
EBI.D11: EFM32.D2(PA2)
EBI.D12: EFM32.D1(PA3)
EBI.D13: EFM32.E3(PA4)
EBI.D14: EFM32.E2(PA5)
EBI.D15: EFM32.E1(PA6)
EBI.REn: EFM32.A7(PF5) ; port EBI.EBI.REn
EBI.WEn: EFM32.B6(PF8) ; port EBI.EBI.WEn
GPIO.0: EFM32.H4(PA7) ; port GPIO.GPIO.0
GPIO.1: EFM32.H5(PA8) ; port GPIO.GPIO.1
GPIO.2: EFM32.J5(PA9) ; port GPIO.GPIO.2
GPIO.3: EFM32.J6(PA10) ; port GPIO.GPIO.3
GPIO.4: EFM32.K5(PA11) ; port GPIO.GPIO.4
SPI.CLK: EFM32.J9(PD2) ; port SPI.SPI.CLK  [project net EFM_CLK]
SPI.CS: EFM32.J10(PD3) ; port SPI.SPI.CS
SPI.RX: EFM32.K11(PD1) ; port SPI.SPI.RX  [project net EFM_RX]
SPI.TX: EFM32.L11(PD0) ; port SPI.SPI.TX
NetARM_20_7: ARM_20.7 EFM32.E8(PF0)
NetARM_20_9: ARM_20.9 EFM32.D8(PF1)
NetARM_20_13: ARM_20.13 EFM32.C8(PF2)
NetARM_20_15: ARM_20.15 EFM32.K6(RESETn) RESET_BTN.2 RESET_BTN.4
NetC39_1: C39.1 EFM32.F11(DECOUPLE)
NetEFM32_C4: EFM32.C4(PD13) ; port ZOOM_IN
NetEFM32_C5: EFM32.C5(PD12) ; port ZOOM_OUT
NetEFM32_C10: EFM32.C10(PC10) R10.2 ; port DONE_SIGNAL
NetEFM32_C11: EFM32.C11(PC11) ; port BACKUP_VREF
NetEFM32_H1: EFM32.H1(PC0) ; port JOYSTICK_INPUT.DOWN
NetEFM32_H2: EFM32.H2(PC2) ; port JOYSTICK_INPUT.UP
NetEFM32_H8: EFM32.H8(PD8) R11.1 ; port INIT_B
NetEFM32_J1: EFM32.J1(PC1) ; port JOYSTICK_INPUT.LEFT
NetEFM32_J2: EFM32.J2(PC3) ; port JOYSTICK_INPUT.PRESSED
NetEFM32_J3: EFM32.J3(PD15) H29.1
NetEFM32_K2: EFM32.K2(PC4) ; port JOYSTICK_INPUT.RIGHT
NetEFM32_L1: EFM32.L1(PB8) ; port LFXTAL_N
NetEFM32_L2: EFM32.L2(PC5) ; port JOYSTICK_INPUT.NEUTRAL
NetEFM32_L5: EFM32.L5(PB11) ; port DAC_CH0
NetEFM32_L6: EFM32.L6(PB12) ; port DAC_CH1
NetEFM32_L9: EFM32.L9(PB14) ; port HFXTAL_N

Not connected (* = marked no-connect by the designer): ARM_20 2 3 5 11 17 19; EFM32 A6(PF7) A8(PF12) A10(PF10) A11(PF11) B5(PD11) B7(PF6) C6(PF9) D3(PB15) D11(PC9) H3(PD14) H9(PD5) H10(PD6) H11(PD7) J11(PD4) K1(PB7) L8(PB13)

### Buses and harness runs
bus EBI.A[0..22]
bus EBI.D[0..15]

### Library data of the parts
ARM_20 = Header 10X2: Header, 10-Pin, Dual row; LatestRevisionDate: 17-Jul-2002; LatestRevisionNote: Re-released for DXP Platform.; Publisher: Altium Limited
C39 = CMP-1035-00001-1: as C54 on sheet Clocks; Max Thickness: 1 mm; Tolerance: Â±0.1pF; Value: 1uF; Technology: SMT; Rated Voltage: 10 V
EFM32 = EFM32GG990F1024-BGA112: as EFM32 on sheet EFM Power; DatasheetVersion: Rev 1.00; PackageVersion: Rev. 97SPP01315A_X03_06Jun11; PackageReference: BGA112; PackageDescription: 112-Pin Ball Grid Array, Body 10 x 10 mm, Pitch 0.8 mm; Supplier 1: Digi-Key; Supplier Part Number 1: 914-1051-2-ND; Supplier 2: Digi-Key; Supplier Part Number 2: 914-1051-1-ND; Supplier 3: Digi-Key; Supplier Part Number 3: 914-1051-6-ND; Supplier 4: Mouser; Supplier Part Number 4: 904-EFM32GG990F1024; ARM Cortex CPU: M3; Subcategory: EFM32 Giant Gecko; Supply Voltage (V): 1.85 - 3.8; USB: Y; Mounting Technology: Surface Mount; Generic Part Number: EFM32GG990; PartNumber: EFM32GG990F1024-BGA112; ComponentLink1Description: Manufacturer URL; ComponentLink1URL: http://www.energymicro.com/; ComponentLink2Description: Datasheet; ComponentLink2URL: http://cdn.energymicro.com/dl/devices/pdf/d0046_efm32gg990_datasheet.pdf; ComponentLink3Description: Package Specification; ComponentLink3URL: http://cdn.energymicro.com/dl/devices/pdf/d0007_efm32g290_datasheet.pdf
H29 = Header 2: Header, 2-Pin; LatestRevisionDate: 17-Jul-2002; LatestRevisionNote: Re-released for DXP Platform.; Publisher: Altium Limited
R10 R11 = CMP-1012-00002-1: as R8 on sheet FPGA Bank 2; Power: 0.1 W; Technology: SMT; Tolerance: 5 %
  R10: Value: 330 Ohm
  R11: Value: 4.7 kOhm
RESET_BTN = switch-button

## Sheet DAC.SchDoc
size A4
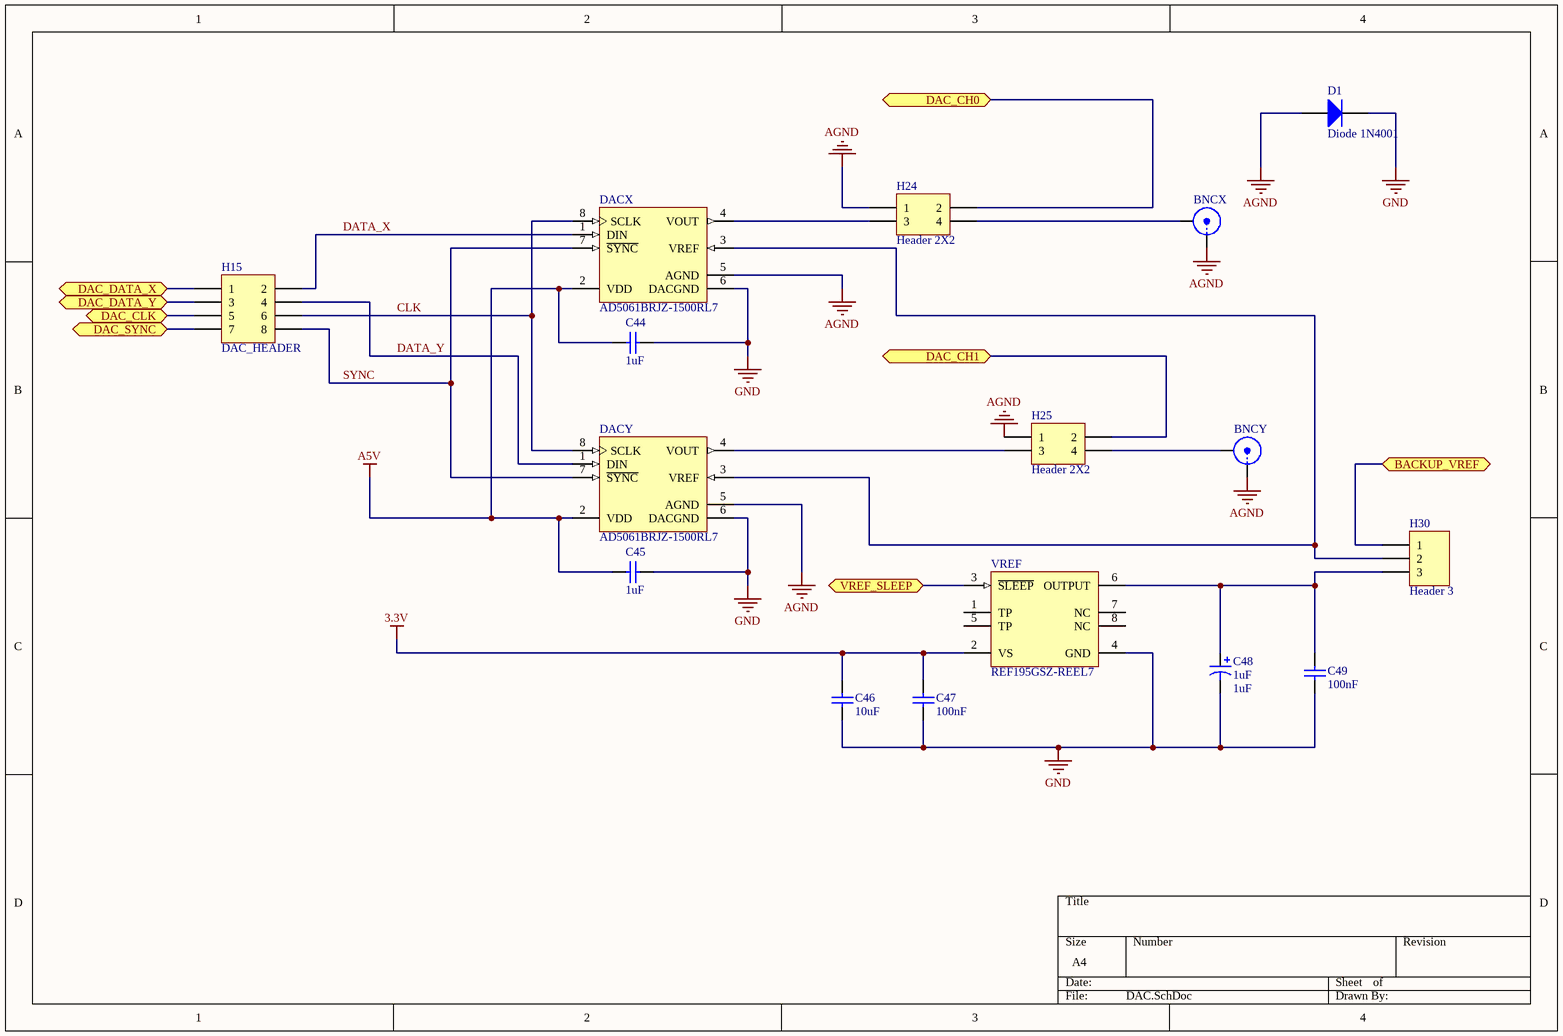
[diagram p10: DAC.SchDoc]

### Parts
BNCX  BNC  [BNC_RA CON]  (value not drawn)
BNCY  BNC  [BNC_RA CON]  (value not drawn)
C44  1uF  [CAPC0603(1608)100_M]
C45  1uF  [CAPC0603(1608)100_M]
C46  10uF  [CAPC0603(1608)100_M]
C47  100nF  [CAPC0603(1608)100_M]
C48  1uF  [C0805]
C49  100nF  [CAPC0603(1608)100_M]
D1  Diode 1N4001  [DO-41]
DACX  AD5061BRJZ-1500RL7  [RJ-8_N]
DACY  AD5061BRJZ-1500RL7  [RJ-8_N]
H15  DAC_HEADER  [HDR2X4]
H24  Header 2X2  [HDR2X2]
H25  Header 2X2  [HDR2X2]
H30  Header 3  [HDR1X3]
VREF  REF195GSZ-REEL7  [ADI-R-8_N]

### Ports
BACKUP_VREF, DAC_CH0, DAC_CH1, DAC_CLK, DAC_DATA_X, DAC_DATA_Y, DAC_SYNC, VREF_SLEEP

### Nets
3.3V: C46.2 C47.2 VREF.2(VS)
A5V: C44.1 C45.1 DACX.2(VDD) DACY.2(VDD)
AGND: BNCX.1(X) BNCY.1(X) D1.1(A) DACX.5(AGND) DACY.5(AGND) H24.1 H25.1
GND: C44.2 C45.2 C46.1 C47.1 C48.2 C49.1 D1.2(K) DACX.6(DACGND) DACY.6(DACGND) VREF.4(GND)
CLK: DACX.8(SCLK) DACY.8(SCLK) H15.6
DATA_X: DACX.1(DIN) H15.2
DATA_Y: DACY.1(DIN) H15.4
SYNC: DACX.7(~{SYNC}) DACY.7(~{SYNC}) H15.8
NetBNCX_2: BNCX.2(Y) H24.4
NetBNCY_2: BNCY.2(Y) H25.4
NetC48_1: C48.1 C49.2 H30.3 VREF.6(OUTPUT)
NetDACX_3: DACX.3(VREF) DACY.3(VREF) H30.2
NetDACX_4: DACX.4(VOUT) H24.3
NetDACY_4: DACY.4(VOUT) H25.3
NetEFM32_C11: H30.1 ; port BACKUP_VREF
NetEFM32_L5: H24.2 ; port DAC_CH0
NetEFM32_L6: H25.2 ; port DAC_CH1
NetFPGA_A8: VREF.3(~{SLEEP}) ; port VREF_SLEEP
NetFPGA_A11: H15.5 ; port DAC_CLK
NetFPGA_A12: H15.7 ; port DAC_SYNC
NetFPGA_B11: H15.1 ; port DAC_DATA_X
NetFPGA_B12: H15.3 ; port DAC_DATA_Y

Not connected (* = marked no-connect by the designer): VREF 1(TP) 5(TP) 7(NC) 8(NC)

### Library data of the parts
BNCX BNCY = BNC: BNC Elbow Connector; LatestRevisionDate: 17-Jul-2002; LatestRevisionNote: Re-released for DXP Platform.; Publisher: Altium Limited
C44-C47 C49 = CMP-1035-00001-1: as C54 on sheet Clocks; Max Thickness: 1 mm; Tolerance: Â±0.1pF; Technology: SMT; Rated Voltage: 10 V
  C44 C45: Value: 1uF
  C46: Value: 10uF
  C47 C49: Value: 100nF
C48 = Cap Pol3: Polarized Capacitor (Surface Mount); Published: 8-Jun-2000; LatestRevisionDate: 29-May-2009; LatestRevisionNote: IPC-7351 Footprint Added.; PackageReference: C0805; Publisher: Altium Limited; PackageDescription: Chip Capacitor; Value: 1uF
D1 = Diode 1N4001: 1 Amp General Purpose Rectifier; Published: 8-Jun-2000; LatestRevisionDate: 17-Jul-2002; LatestRevisionNote: Re-released for DXP Platform.; DatasheetVersion: 1998; PackageVersion: Aug-1999; PackageReference: DO-41; Publisher: Altium Limited; PackageDescription: Diode, Axial; Body 5.2 x 2.7 mm (LxDia. max), Lead Dia. 0.86 mm (max); Code_JEDEC: DO-204-AL; ComponentLink1Description: Manufacturer Link; ComponentLink1URL: http://www.fairchildsemi.com/; ComponentLink2Description: Datasheet; ComponentLink2URL: http://www.fairchildsemi.com/ds/1N%2F1N4001.pdf
DACX DACY = AD5061BRJZ-1500RL7: Single 16-Bit Voltage Output nanoDAC with SPI Interface, 2.7 to 5.5 V, -40 to +85 degC, RJ-8, Pb-Free, Reel; Generic Part Number: AD5061; Manufacturer: Analog Devices; # DAC Outputs: 1; Max V+: 5.5V; Op Pwr Diss: 5mW; Resolution (Bits): 16; Settling Time: 4µs; Single Supply: Yes; DatasheetVersion: Rev.B; PackageVersion: 121608-A; PackageReference: RJ-8; PackageDescription: 8-Lead Thin Small Outline Transistor Package [SOT-23]; Supplier 1: Digi-Key; Supplier Part Number 1: AD5061BRJZ-1500RL7TR-ND; Supplier 2: Digi-Key; Supplier Part Number 2: AD5061BRJZ-1500RL7CT-ND; Supplier 3: Digi-Key; Supplier Part Number 3: AD5061BRJZ-1500RL7DKR-ND; Supplier 4: Farnell; Supplier Part Number 4: 2067828; Supplier 5: Newark; Supplier Part Number 5: 72T0896; Supplier 6: Mouser; Supplier Part Number 6: 584-AD5061BRJZ1500R7; Packing: Reel; RoHS: Y; Mounting Technology: Surface Mount; Code_JEDEC: MO-178-BA; PartNumber: AD5061BRJZ-1500RL7; ComponentLink1Description: Manufacturer URL; ComponentLink1URL: http://www.analog.com/en/index.html; ComponentLink2Description: Datasheet; ComponentLink2URL: http://www.analog.com/static/imported-files/data_sheets/AD5061.pdf; ComponentLink3Description: Package Specification; ComponentLink3URL: http://www.analog.com/static/imported-files/packages/PKG_PDF/SOT-23(RJ)/RJ_8.pdf; ComponentLink4Description: Product URL; ComponentLink4URL: http://www.analog.com/en/digital-to-analog-converters/da-converters/ad5061/products/product.html
H15 = Header 4X2: Header, 4-Pin, Dual row; LatestRevisionDate: 17-Jul-2002; LatestRevisionNote: Re-released for DXP Platform.; Publisher: Altium Limited
H24 H25 = Header 2X2: Header, 2-Pin, Dual row; LatestRevisionDate: 17-Jul-2002; LatestRevisionNote: Re-released for DXP Platform.; Publisher: Altium Limited
H30 = Header 3: Header, 3-Pin; LatestRevisionDate: 17-Jul-2002; LatestRevisionNote: Re-released for DXP Platform.; Publisher: Altium Limited
VREF = REF195GSZ-REEL7: Precision Micropower, Low Dropout Voltage Reference, 5 V Output, 5.1 to 15 V Supply, Industrial, 8-pin SOIC (R-8), Reel; Manufacturer: Analog Devices; Ref Out TC (ppm/C): 10; Vout: 5V; DatasheetVersion: Rev. L; PackageVersion: 060506-A, 06/2006; PackageReference: R-8; PackageDescription: 8-Pin Standard Small Outline Package, Body 4.9 x 3.9 mm, Pitch 1.27 mm; Supplier 1: Digi-Key; Supplier Part Number 1: REF195GSZ-REEL7TR-ND; Supplier 2: Digi-Key; Supplier Part Number 2: REF195GSZ-REEL7CT-ND; Supplier 3: Digi-Key; Supplier Part Number 3: REF195GSZ-REEL7DKR-ND; Supplier 4: Newark; Supplier Part Number 4: 59K9054; Supplier 5: Mouser; Supplier Part Number 5: 584-REF195GSZ-R7; Packing: Reel; Operating Temp Range: -40 to 85 degC; Mounting Technology: Surface Mount; Code_JEDEC: MS-012-AA; PartNumber: REF195GSZ-REEL7; ComponentLink1Description: Manufacturer URL; ComponentLink1URL: http://www.analog.com/en/index.html; ComponentLink2Description: Datasheet; ComponentLink2URL: http://www.analog.com/static/imported-files/data_sheets/REF19xSeries.pdf; ComponentLink3Description: Package Specification; ComponentLink3URL: http://www.analog.com/static/imported-files/packages/PKG_PDF/SOIC_Narrow%20(R)/R_8.pdf; ComponentLink4Description: URL Link1; ComponentLink4URL: Product URL:http://www.analog.com/en/special-linear-functions/voltage-references/ref195/products/product.html

## Sheet SRAM.SchDoc
size A4
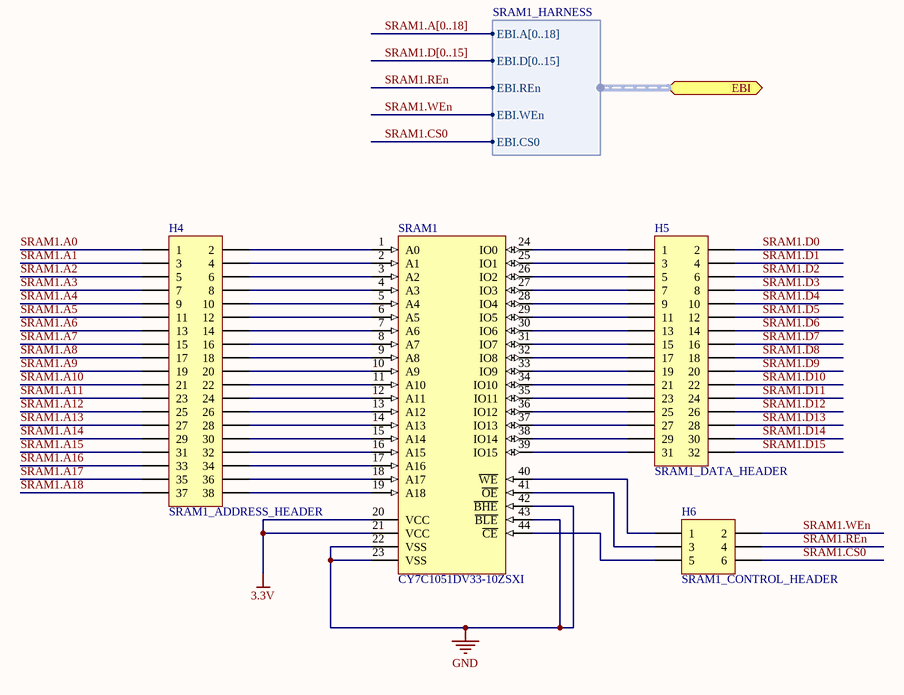
[diagram p11: SRAM.SchDoc]

### Parts
H4  SRAM1_ADDRESS_HEADER  [HDR2X19]
H5  SRAM1_DATA_HEADER  [HDR2X16]
H6  SRAM1_CONTROL_HEADER  [HDR2X3]
SRAM1  CY7C1051DV33-10ZSXI  [TSOP-44-SRAM]

### Ports
EBI (harness SRAM1_HARNESS)

### Harnesses
SRAM1_HARNESS: EBI.A[0..18], EBI.D[0..15], EBI.REn, EBI.WEn, EBI.CS0

### Nets
3.3V: SRAM1.20(VCC) SRAM1.21(VCC)
GND: SRAM1.22(VSS) SRAM1.23(VSS) SRAM1.42(~{BHE}) SRAM1.43(~{BLE})
SRAM1.A0: H4.1
SRAM1.A1: H4.3
SRAM1.A2: H4.5
SRAM1.A3: H4.7
SRAM1.A4: H4.9
SRAM1.A5: H4.11
SRAM1.A6: H4.13
SRAM1.A7: H4.15
SRAM1.A8: H4.17
SRAM1.A9: H4.19
SRAM1.A10: H4.21
SRAM1.A11: H4.23
SRAM1.A12: H4.25
SRAM1.A13: H4.27
SRAM1.A14: H4.29
SRAM1.A15: H4.31
SRAM1.A16: H4.33
SRAM1.A17: H4.35
SRAM1.A18: H4.37
SRAM1.CS0: H6.6 ; port EBI.EBI.CS0  [project net EBI.CS0]
SRAM1.D0: H5.2  [project net EBI.D0]
SRAM1.D1: H5.4  [project net EBI.D1]
SRAM1.D2: H5.6  [project net EBI.D2]
SRAM1.D3: H5.8  [project net EBI.D3]
SRAM1.D4: H5.10  [project net EBI.D4]
SRAM1.D5: H5.12  [project net EBI.D5]
SRAM1.D6: H5.14  [project net EBI.D6]
SRAM1.D7: H5.16  [project net EBI.D7]
SRAM1.D8: H5.18  [project net EBI.D8]
SRAM1.D9: H5.20  [project net EBI.D9]
SRAM1.D10: H5.22  [project net EBI.D10]
SRAM1.D11: H5.24  [project net EBI.D11]
SRAM1.D12: H5.26  [project net EBI.D12]
SRAM1.D13: H5.28  [project net EBI.D13]
SRAM1.D14: H5.30  [project net EBI.D14]
SRAM1.D15: H5.32  [project net EBI.D15]
SRAM1.REn: H6.4 ; port EBI.EBI.REn  [project net EBI.REn]
SRAM1.WEn: H6.2 ; port EBI.EBI.WEn  [project net EBI.WEn]
NetH4_2: H4.2 SRAM1.1(A0)
NetH4_4: H4.4 SRAM1.2(A1)
NetH4_6: H4.6 SRAM1.3(A2)
NetH4_8: H4.8 SRAM1.4(A3)
NetH4_10: H4.10 SRAM1.5(A4)
NetH4_12: H4.12 SRAM1.6(A5)
NetH4_14: H4.14 SRAM1.7(A6)
NetH4_16: H4.16 SRAM1.8(A7)
NetH4_18: H4.18 SRAM1.9(A8)
NetH4_20: H4.20 SRAM1.10(A9)
NetH4_22: H4.22 SRAM1.11(A10)
NetH4_24: H4.24 SRAM1.12(A11)
NetH4_26: H4.26 SRAM1.13(A12)
NetH4_28: H4.28 SRAM1.14(A13)
NetH4_30: H4.30 SRAM1.15(A14)
NetH4_32: H4.32 SRAM1.16(A15)
NetH4_34: H4.34 SRAM1.17(A16)
NetH4_36: H4.36 SRAM1.18(A17)
NetH4_38: H4.38 SRAM1.19(A18)
NetH5_1: H5.1 SRAM1.24(IO0)
NetH5_3: H5.3 SRAM1.25(IO1)
NetH5_5: H5.5 SRAM1.26(IO2)
NetH5_7: H5.7 SRAM1.27(IO3)
NetH5_9: H5.9 SRAM1.28(IO4)
NetH5_11: H5.11 SRAM1.29(IO5)
NetH5_13: H5.13 SRAM1.30(IO6)
NetH5_15: H5.15 SRAM1.31(IO7)
NetH5_17: H5.17 SRAM1.32(IO8)
NetH5_19: H5.19 SRAM1.33(IO9)
NetH5_21: H5.21 SRAM1.34(IO10)
NetH5_23: H5.23 SRAM1.35(IO11)
NetH5_25: H5.25 SRAM1.36(IO12)
NetH5_27: H5.27 SRAM1.37(IO13)
NetH5_29: H5.29 SRAM1.38(IO14)
NetH5_31: H5.31 SRAM1.39(IO15)
NetH6_1: H6.1 SRAM1.40(~{WE})
NetH6_3: H6.3 SRAM1.41(~{OE})
NetH6_5: H6.5 SRAM1.44(~{CE})

### Buses and harness runs
bus SRAM1.A[0..18]
bus SRAM1.D[0..15]

### Library data of the parts
H4 = Header 19X2: Header, 19-Pin, Dual row; LatestRevisionDate: 17-Jul-2002; LatestRevisionNote: Re-released for DXP Platform.; Publisher: Altium Limited
H5 = Header 16X2: Header, 16-Pin, Dual row; LatestRevisionDate: 17-Jul-2002; LatestRevisionNote: Re-released for DXP Platform.; Publisher: Altium Limited
H6 = Header 3X2: Header, 3-Pin, Dual row; LatestRevisionDate: 17-Jul-2002; LatestRevisionNote: Re-released for DXP Platform.; Publisher: Altium Limited
SRAM1 = CY7C1051DV33-10ZSXI: pin to pad: 6>18 7>19 8>20 9>21 10>22 11>23 12>24 13>25 14>26 15>27 16>42 17>43 18>44 19>28 20>11 21>33 22>12 23>34 24>7 25>8 26>9 27>10 28>13 29>14 30>15 31>16 32>29 33>30 34>31 35>32 36>35 37>36 38>37 39>38 40>17 42>40 43>39 44>6

## Sheet Power Supply.SchDoc: =DocumentName
size A4; DocumentName: Power Supply
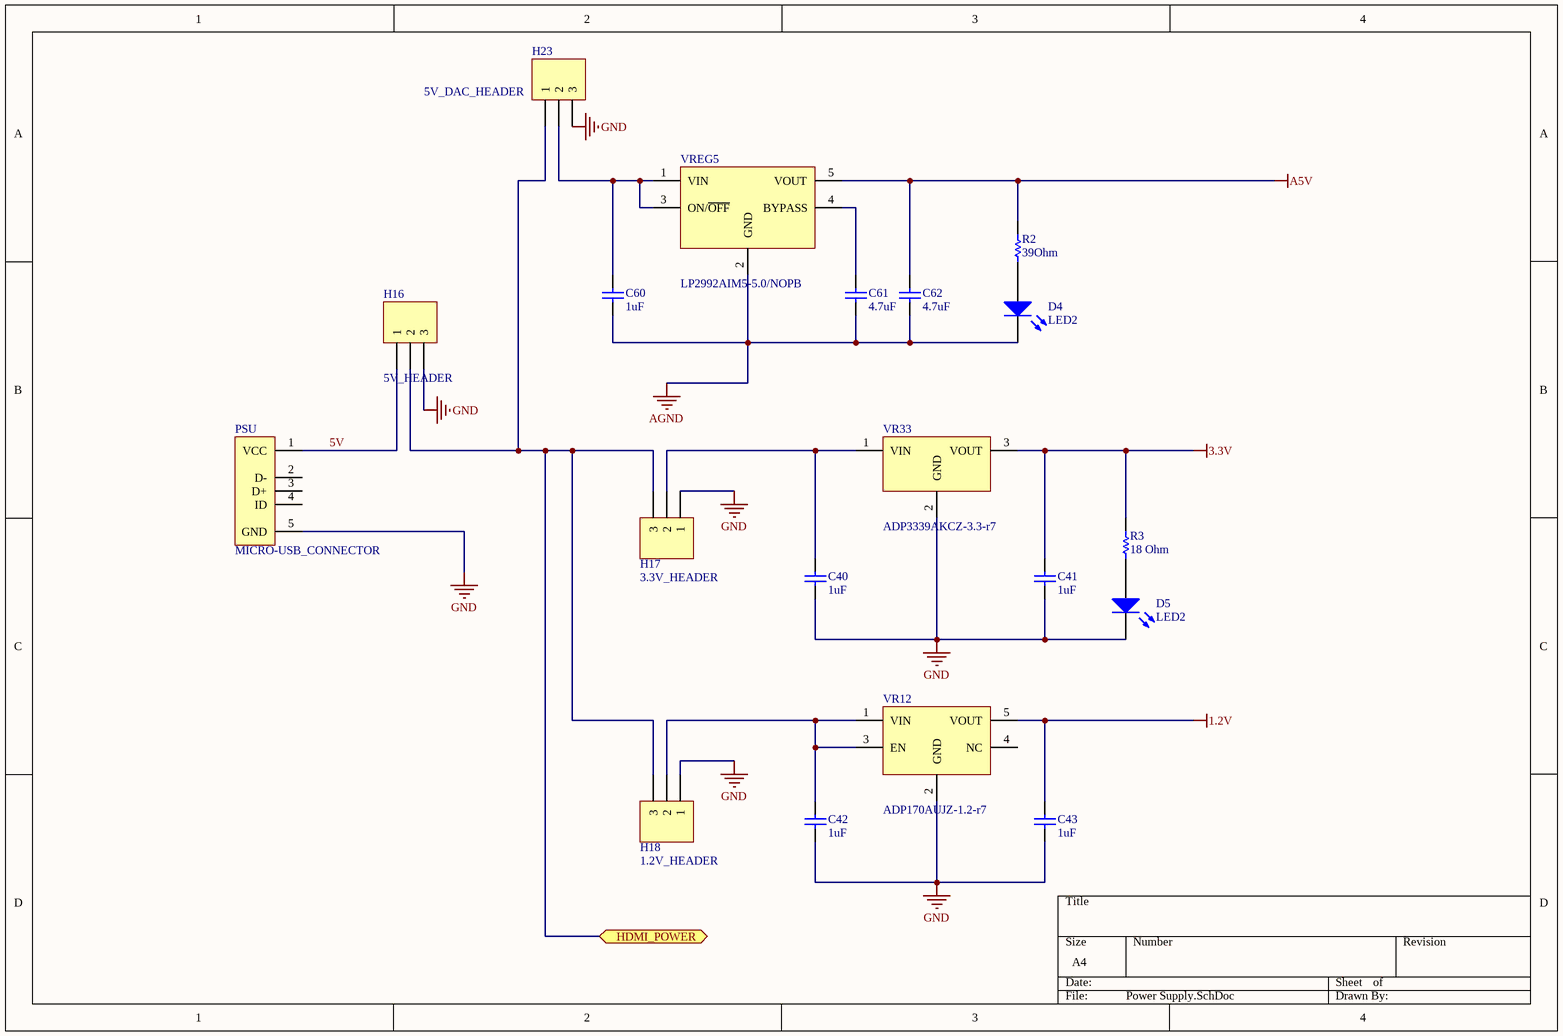
[diagram p12: Power Supply.SchDoc]

### Parts
C40  1uF  [CAPC0603(1608)100_M]
C41  1uF  [CAPC0603(1608)100_M]
C42  1uF  [CAPC0603(1608)100_M]
C43  1uF  [CAPC0603(1608)100_M]
C60  1uF  [CAPC0603(1608)100_M]
C61  4.7uF  [CAPC0603(1608)100_M]
C62  4.7uF  [CAPC0603(1608)100_M]
D4  LED2  [3.2X1.6X1.1]
D5  LED2  [3.2X1.6X1.1]
H16  5V_HEADER  [HDR1X3]
H17  3.3V_HEADER  [HDR1X3]
H18  1.2V_HEADER  [HDR1X3]
H23  5V_DAC_HEADER  [HDR1X3]
PSU  MICRO-USB_CONNECTOR  [MICRO-USB]
R2  39Ohm  [RESC0603(1608)_M]
R3  18 Ohm  [RESC0603(1608)_M]
VR12  ADP170AUJZ-1.2-r7  [VREG-1.2]
VR33  ADP3339AKCZ-3.3-r7  [VREG-3.3]
VREG5  LP2992AIM5-5.0/NOPB  [VREG-5]

### Ports
HDMI_POWER

### Nets
1.2V: C43.2 VR12.5(VOUT)
3.3V: C41.2 R3.2 VR33.3(VOUT)
A5V: C62.2 R2.2 VREG5.5(VOUT)
AGND: C60.1 C61.1 C62.1 D4.2(K) VREG5.2(GND)
GND: C40.1 C41.1 C42.1 C43.1 D5.2(K) H16.3 H17.1 H18.1 H23.3 PSU.5(GND) VR12.2(GND) VR33.2(GND)
5V: H16.1 PSU.1(VCC)
NetC40_2: C40.2 H17.2 VR33.1(VIN)
NetC42_2: C42.2 H18.2 VR12.1(VIN) VR12.3(EN)
NetC60_2: C60.2 H23.2 VREG5.1(VIN) VREG5.3(ON/~{OFF})
NetC61_2: C61.2 VREG5.4(BYPASS)
NetD4_1: D4.1(A) R2.1
NetD5_1: D5.1(A) R3.1
NetH14_1: H16.2 H17.3 H18.3 H23.1 ; port HDMI_POWER

Not connected (* = marked no-connect by the designer): PSU 2(D-) 3(D+) 4(ID); VR12 4(NC)

### Library data of the parts
C40-C43 C60-C62 = CMP-1035-00001-1: as C54 on sheet Clocks; Max Thickness: 1 mm; Tolerance: Â±0.1pF; Technology: SMT; Rated Voltage: 10 V
  C40-C43 C60: Value: 1uF
  C61 C62: Value: 4.7uF
D4 D5 = LED2: as D3 on sheet FPGA Config; Published: 8-Jun-2000; LatestRevisionDate: 17-Jul-2002; LatestRevisionNote: Re-released for DXP Platform.; PackageVersion: Feb-2002; PackageReference: 3.2X1.6X1.1; Publisher: Altium Limited; PackageDescription: SM LED; 2 Flat Leads
H16-H18 H23 = Header 3: Header, 3-Pin; LatestRevisionDate: 17-Jul-2002; LatestRevisionNote: Re-released for DXP Platform.; Publisher: Altium Limited
R2 R3 = CMP-1012-00002-1: as R8 on sheet FPGA Bank 2; Power: 0.1 W; Technology: SMT; Tolerance: 5 %
  R2: Value: 39Ohm
  R3: Value: 18 Ohm
VR33 = ADP3339AKCZ-3.3-r7: pin to pad: 1>3 2>1 3>2

## Sheet Flash.SchDoc
size A4
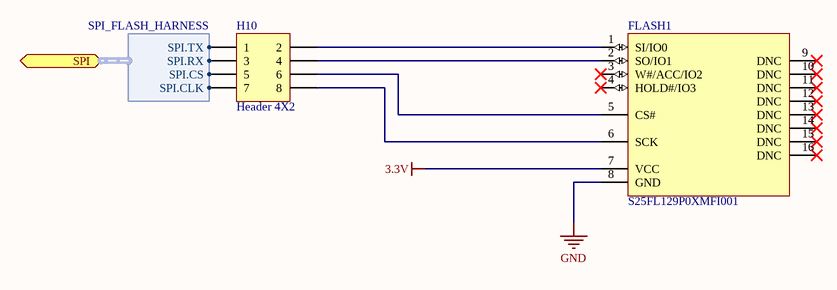
[diagram p13: Flash.SchDoc]

### Parts
FLASH1  S25FL129P0XMFI001  [SOIC-16-FLASH]
H10  Header 4X2  [HDR2X4]

### Ports
SPI (harness SPI_FLASH_HARNESS)

### Harnesses
SPI_FLASH_HARNESS: SPI.TX, SPI.RX, SPI.CLK, SPI.CS

### Nets
3.3V: FLASH1.7(VCC)
GND: FLASH1.8(GND)
EFM_CLK: H10.7 ; port SPI.SPI.CLK
EFM_RX: H10.3 ; port SPI.SPI.RX
SPI.CS: H10.5 ; port SPI.SPI.CS
SPI.TX: H10.1 ; port SPI.SPI.TX
NetFLASH1_1: FLASH1.1(SI/IO0) H10.2
NetFLASH1_2: FLASH1.2(SO/IO1) H10.4
NetFLASH1_5: FLASH1.5(CS#) H10.6
NetFLASH1_6: FLASH1.6(SCK) H10.8

Not connected (* = marked no-connect by the designer): FLASH1 3(W#/ACC/IO2)* 4(HOLD#/IO3)* 9(DNC)* 10(DNC)* 11(DNC)* 12(DNC)* 13(DNC)* 14(DNC)* 15(DNC)* 16(DNC)*

### Library data of the parts
FLASH1 = S25FL129P0XMFI001: pin to pad: 1>15 2>8 3>9 4>1 5>7 6>16 7>2 8>10 9>3 10>4 11>5 12>6 13>11 14>12 15>13 16>14
H10 = Header 4X2: Header, 4-Pin, Dual row; LatestRevisionDate: 17-Jul-2002; LatestRevisionNote: Re-released for DXP Platform.; Publisher: Altium Limited

## Sheet HDMI.SchDoc
size A4
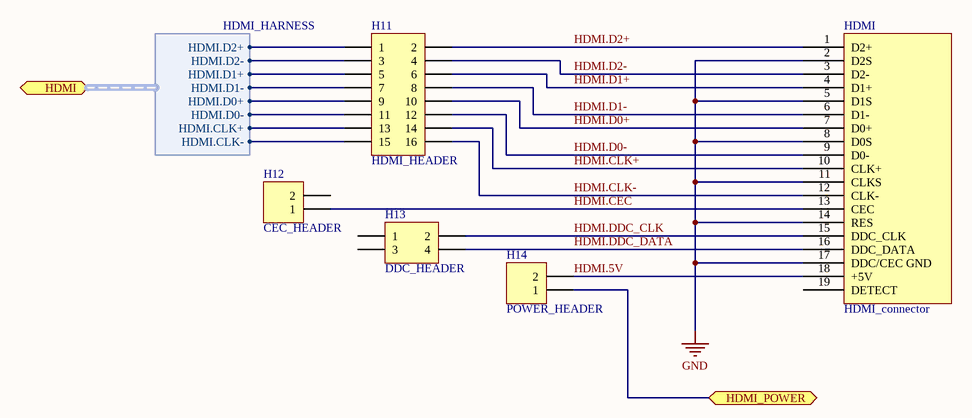
[diagram p14: HDMI.SchDoc]

### Parts
H11  HDMI_HEADER  [HDR2X8]
H12  CEC_HEADER  [HDR1X2]
H13  DDC_HEADER  [HDR2X2]
H14  POWER_HEADER  [HDR1X2]
HDMI  HDMI_connector  [HDMI-type-A]

### Ports
HDMI (harness HDMI_HARNESS), HDMI_POWER

### Harnesses
HDMI_HARNESS: HDMI.D2+, HDMI.D2-, HDMI.D1+, HDMI.D1-, HDMI.D0+, HDMI.D0-, HDMI.CLK+, HDMI.CLK-

### Nets
GND: HDMI.2(D2S) HDMI.5(D1S) HDMI.8(D0S) HDMI.11(CLKS) HDMI.14(RES) HDMI.17(DDC/CEC_GND)
FPGAB.CLK+: H11.13 ; port HDMI.HDMI.CLK+
FPGAB.CLK-: H11.15 ; port HDMI.HDMI.CLK-
FPGAB.D0+: H11.9 ; port HDMI.HDMI.D0+
FPGAB.D0-: H11.11 ; port HDMI.HDMI.D0-
FPGAB.D1+: H11.5 ; port HDMI.HDMI.D1+
FPGAB.D1-: H11.7 ; port HDMI.HDMI.D1-
FPGAB.D2+: H11.1 ; port HDMI.HDMI.D2+
FPGAB.D2-: H11.3 ; port HDMI.HDMI.D2-
HDMI.5V: H14.2 HDMI.18(+5V)
HDMI.CEC: H12.1 HDMI.13(CEC)
HDMI.CLK+: H11.14 HDMI.10(CLK+)
HDMI.CLK-: H11.16 HDMI.12(CLK-)
HDMI.D0+: H11.10 HDMI.7(D0+)
HDMI.D0-: H11.12 HDMI.9(D0-)
HDMI.D1+: H11.6 HDMI.4(D1+)
HDMI.D1-: H11.8 HDMI.6(D1-)
HDMI.D2+: H11.2 HDMI.1(D2+)
HDMI.D2-: H11.4 HDMI.3(D2-)
HDMI.DDC_CLK: H13.2 HDMI.15(DDC_CLK)
HDMI.DDC_DATA: H13.4 HDMI.16(DDC_DATA)
NetH14_1: H14.1 ; port HDMI_POWER

Not connected (* = marked no-connect by the designer): H12 2; H13 1 3; HDMI 19(DETECT)

### Library data of the parts
H11 = Header 8X2: Header, 8-Pin, Dual row; LatestRevisionDate: 17-Jul-2002; LatestRevisionNote: Re-released for DXP Platform.; Publisher: Altium Limited
H12 H14 = Header 2: Header, 2-Pin; LatestRevisionDate: 17-Jul-2002; LatestRevisionNote: Re-released for DXP Platform.; Publisher: Altium Limited
H13 = Header 2X2: Header, 2-Pin, Dual row; LatestRevisionDate: 17-Jul-2002; LatestRevisionNote: Re-released for DXP Platform.; Publisher: Altium Limited

## Sheet JoystickButtons.SchDoc
size A4
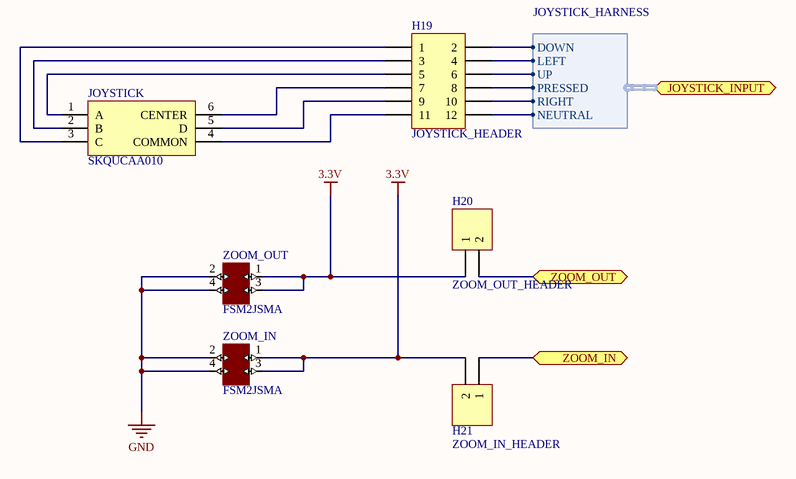
[diagram p15: JoystickButtons.SchDoc]

### Parts
H19  JOYSTICK_HEADER  [HDR2X6]
H20  ZOOM_OUT_HEADER  [HDR1X2]
H21  ZOOM_IN_HEADER  [HDR1X2]
JOYSTICK  SKQUCAA010  [5-WAY-JOYSTICK]
ZOOM_IN  FSM2JSMA  [Button]
ZOOM_OUT  FSM2JSMA  [Button]

### Ports
JOYSTICK_INPUT (harness JOYSTICK_HARNESS), ZOOM_IN, ZOOM_OUT

### Harnesses
JOYSTICK_HARNESS: UP, LEFT, DOWN, NEUTRAL, RIGHT, PRESSED

### Nets
3.3V: H20.1 H21.2 ZOOM_IN.1 ZOOM_IN.3 ZOOM_OUT.1 ZOOM_OUT.3
GND: ZOOM_IN.2 ZOOM_IN.4 ZOOM_OUT.2 ZOOM_OUT.4
NetEFM32_C4: H21.1 ; port ZOOM_IN
NetEFM32_C5: H20.2 ; port ZOOM_OUT
NetEFM32_H1: H19.2 ; port JOYSTICK_INPUT.DOWN
NetEFM32_H2: H19.6 ; port JOYSTICK_INPUT.UP
NetEFM32_J1: H19.4 ; port JOYSTICK_INPUT.LEFT
NetEFM32_J2: H19.8 ; port JOYSTICK_INPUT.PRESSED
NetEFM32_K2: H19.10 ; port JOYSTICK_INPUT.RIGHT
NetEFM32_L2: H19.12 ; port JOYSTICK_INPUT.NEUTRAL
NetH19_1: H19.1 JOYSTICK.3(C)
NetH19_3: H19.3 JOYSTICK.2(B)
NetH19_5: H19.5 JOYSTICK.1(A)
NetH19_7: H19.7 JOYSTICK.6(CENTER)
NetH19_9: H19.9 JOYSTICK.5(D)
NetH19_11: H19.11 JOYSTICK.4(COMMON)

### Library data of the parts
H19 = Header 6X2: Header, 6-Pin, Dual row; LatestRevisionDate: 17-Jul-2002; LatestRevisionNote: Re-released for DXP Platform.; Publisher: Altium Limited
H20 H21 = Header 2: Header, 2-Pin; LatestRevisionDate: 17-Jul-2002; LatestRevisionNote: Re-released for DXP Platform.; Publisher: Altium Limited
ZOOM_IN ZOOM_OUT = switch-button